# EAGLE schematic display-r2 (EAGLE 6.6.0)
DATABASE: /home/mike/core/eagle/partsdb.txt

## Sheet 1 of 9
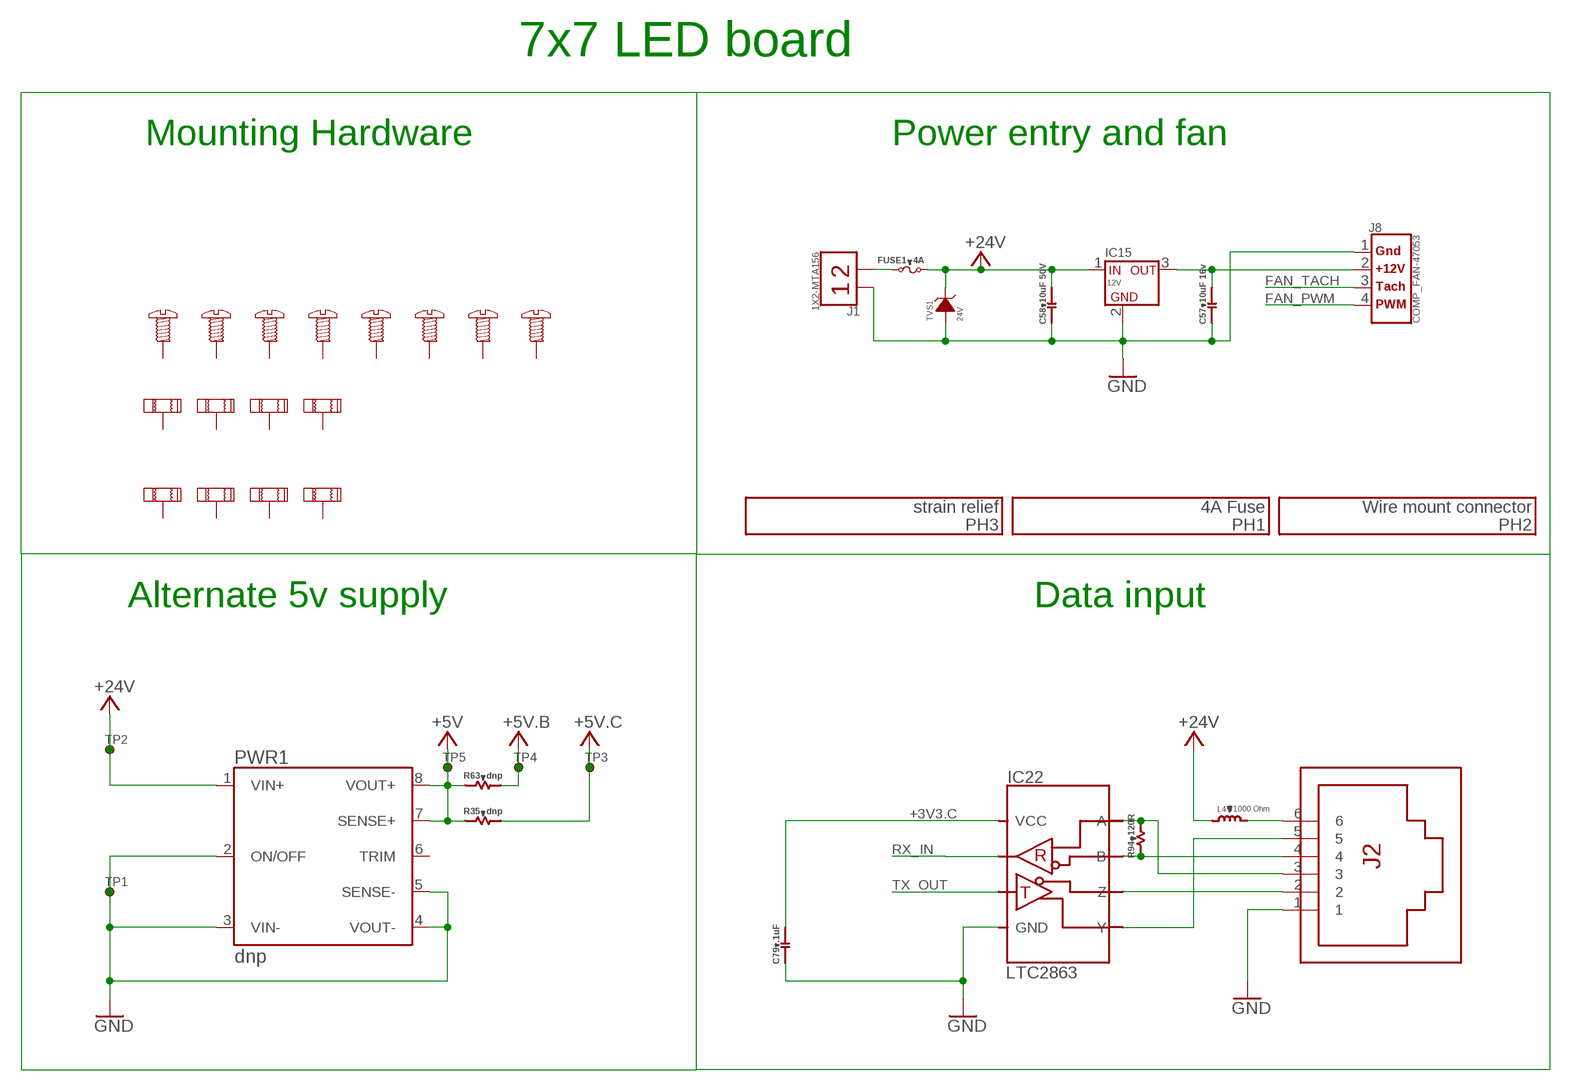
[diagram p0: schematic, sheet 1]
PH1 (BOM-PART): PARTNO: BK1-S505H-4-R
PH2 (BOM-PART): PARTNO: 3-644465-2
PH3 (BOM-PART): PARTNO: 643071-2

### Parts
C57  10uF 16v  C0805  [C0805B]
C58  10uF 50V  C1206  [C1206B]
C79  .1uF  C0603  [C0603B]
FUSE1  4A  F-649  [649]
IC15  12V  P7805-Q24-S12-S  [P7805]
IC22  LTC2863  [SO08]
J1  1X2-MTA156  [640445-2]
J2  RJ12-JACK-RJE01  [RJE01-660-01]
J8  COMP_FAN-47053  [47053]
L4  1000 Ohm  L0603  [R0603B]
NUT1  NUTSMTSO-632  [SMTSO-632-2ET]
NUT2  NUTSMTSO-632  [SMTSO-632-2ET]
NUT3  NUTSMTSO-632  [SMTSO-632-2ET]
NUT4  NUTSMTSO-632  [SMTSO-632-2ET]
NUT5  NUTSMTSO-832  [SMTSO-832-2ET]
NUT6  NUTSMTSO-832  [SMTSO-832-2ET]
NUT7  NUTSMTSO-832  [SMTSO-832-2ET]
NUT8  NUTSMTSO-832  [SMTSO-832-2ET]
PWR1  dnp  EHHD024A0A  [PWR-1/4-BRICK]
R35  dnp  R0805  [R0805B]
R63  dnp  R0805  [R0805B]
R94  120R  R1206  [R1206B]
SCREW1  SCREW-632-0-PSHP  [SMTPR-6-1]
SCREW2  SCREW-632-0-PSHP  [SMTPR-6-1]
SCREW3  SCREW-632-0-PSHP  [SMTPR-6-1]
SCREW4  SCREW-632-0-PSHP  [SMTPR-6-1]
SCREW5  SCREW-632-0-PSHP  [SMTPR-6-1]
SCREW6  SCREW-632-0-PSHP  [SMTPR-6-1]
SCREW7  SCREW-632-0-PSHP  [SMTPR-6-1]
SCREW8  SCREW-632-0-PSHP  [SMTPR-6-1]
TP1  TP-CIR30  [SMD_CIR30]
TP2  TP-CIR30  [SMD_CIR30]
TP3  TP-CIR30  [SMD_CIR30]
TP4  TP-CIR30  [SMD_CIR30]
TP5  TP-CIR30  [SMD_CIR30]
TVS1  24V  TVS-SMC  [SMC/DO214AB]

### Nets
+3V3.C: C79.2 IC22.1(VCC) ; also sheet 6
+5V: PWR1.7(SENSE+) PWR1.8(VOUT+) R35.1 R63.1 TP5.P$1 ; also sheet 4,5,7
+5VB: R63.2 TP4.P$1 ; supply symbol labelled +5V.B ; also sheet 2,5,6,8
+5VC: R35.2 TP3.P$1 ; supply symbol labelled +5V.C ; also sheet 2,3,9
+24V: C58.2 FUSE1.2 IC15.1(IN) L4.1 PWR1.1(VIN+) TP2.P$1 TVS1.C(CATHODE) ; also sheet 4,7,8,9
+24V_OUT: J2.6 L4.2
FAN_PWM: J8.4 ; also sheet 5
FAN_TACH: J8.3 ; also sheet 5
GND: C57.1 C58.1 C79.1 IC15.2(GND) IC22.4(GND) J1.1 J2.1 J8.1 PWR1.2(ON/OFF) PWR1.3(VIN-) PWR1.4(VOUT-) PWR1.5(SENSE-) TP1.P$1 TVS1.A(ANODE) ; also sheet 2,3,4,5,6,7,8,9
N$184: FUSE1.1 J1.2
N$185: IC22.7(B) J2.4 R94.1
N$186: IC22.8(A) J2.3 R94.2
N$187: IC22.6(Z) J2.2
N$188: IC22.5(Y) J2.5
OUT: C57.2 IC15.3(OUT) J8.2
RX_IN: IC22.2(RO) ; also sheet 2
TX_OUT: IC22.3(DI) ; also sheet 6
Unconnected: NUT1.P$1 NUT2.P$1 NUT3.P$1 NUT4.P$1 NUT5.1 NUT6.1 NUT7.1 NUT8.1 PWR1.6(TRIM) SCREW1.P$1 SCREW2.P$1 SCREW3.P$1 SCREW4.P$1 SCREW5.P$1 SCREW6.P$1 SCREW7.P$1 SCREW8.P$1

### Notes on the sheet
- 7x7 LED board
- Mounting Hardware | Power entry and fan
- Alternate 5v supply | Data input

## Sheet 2 of 9
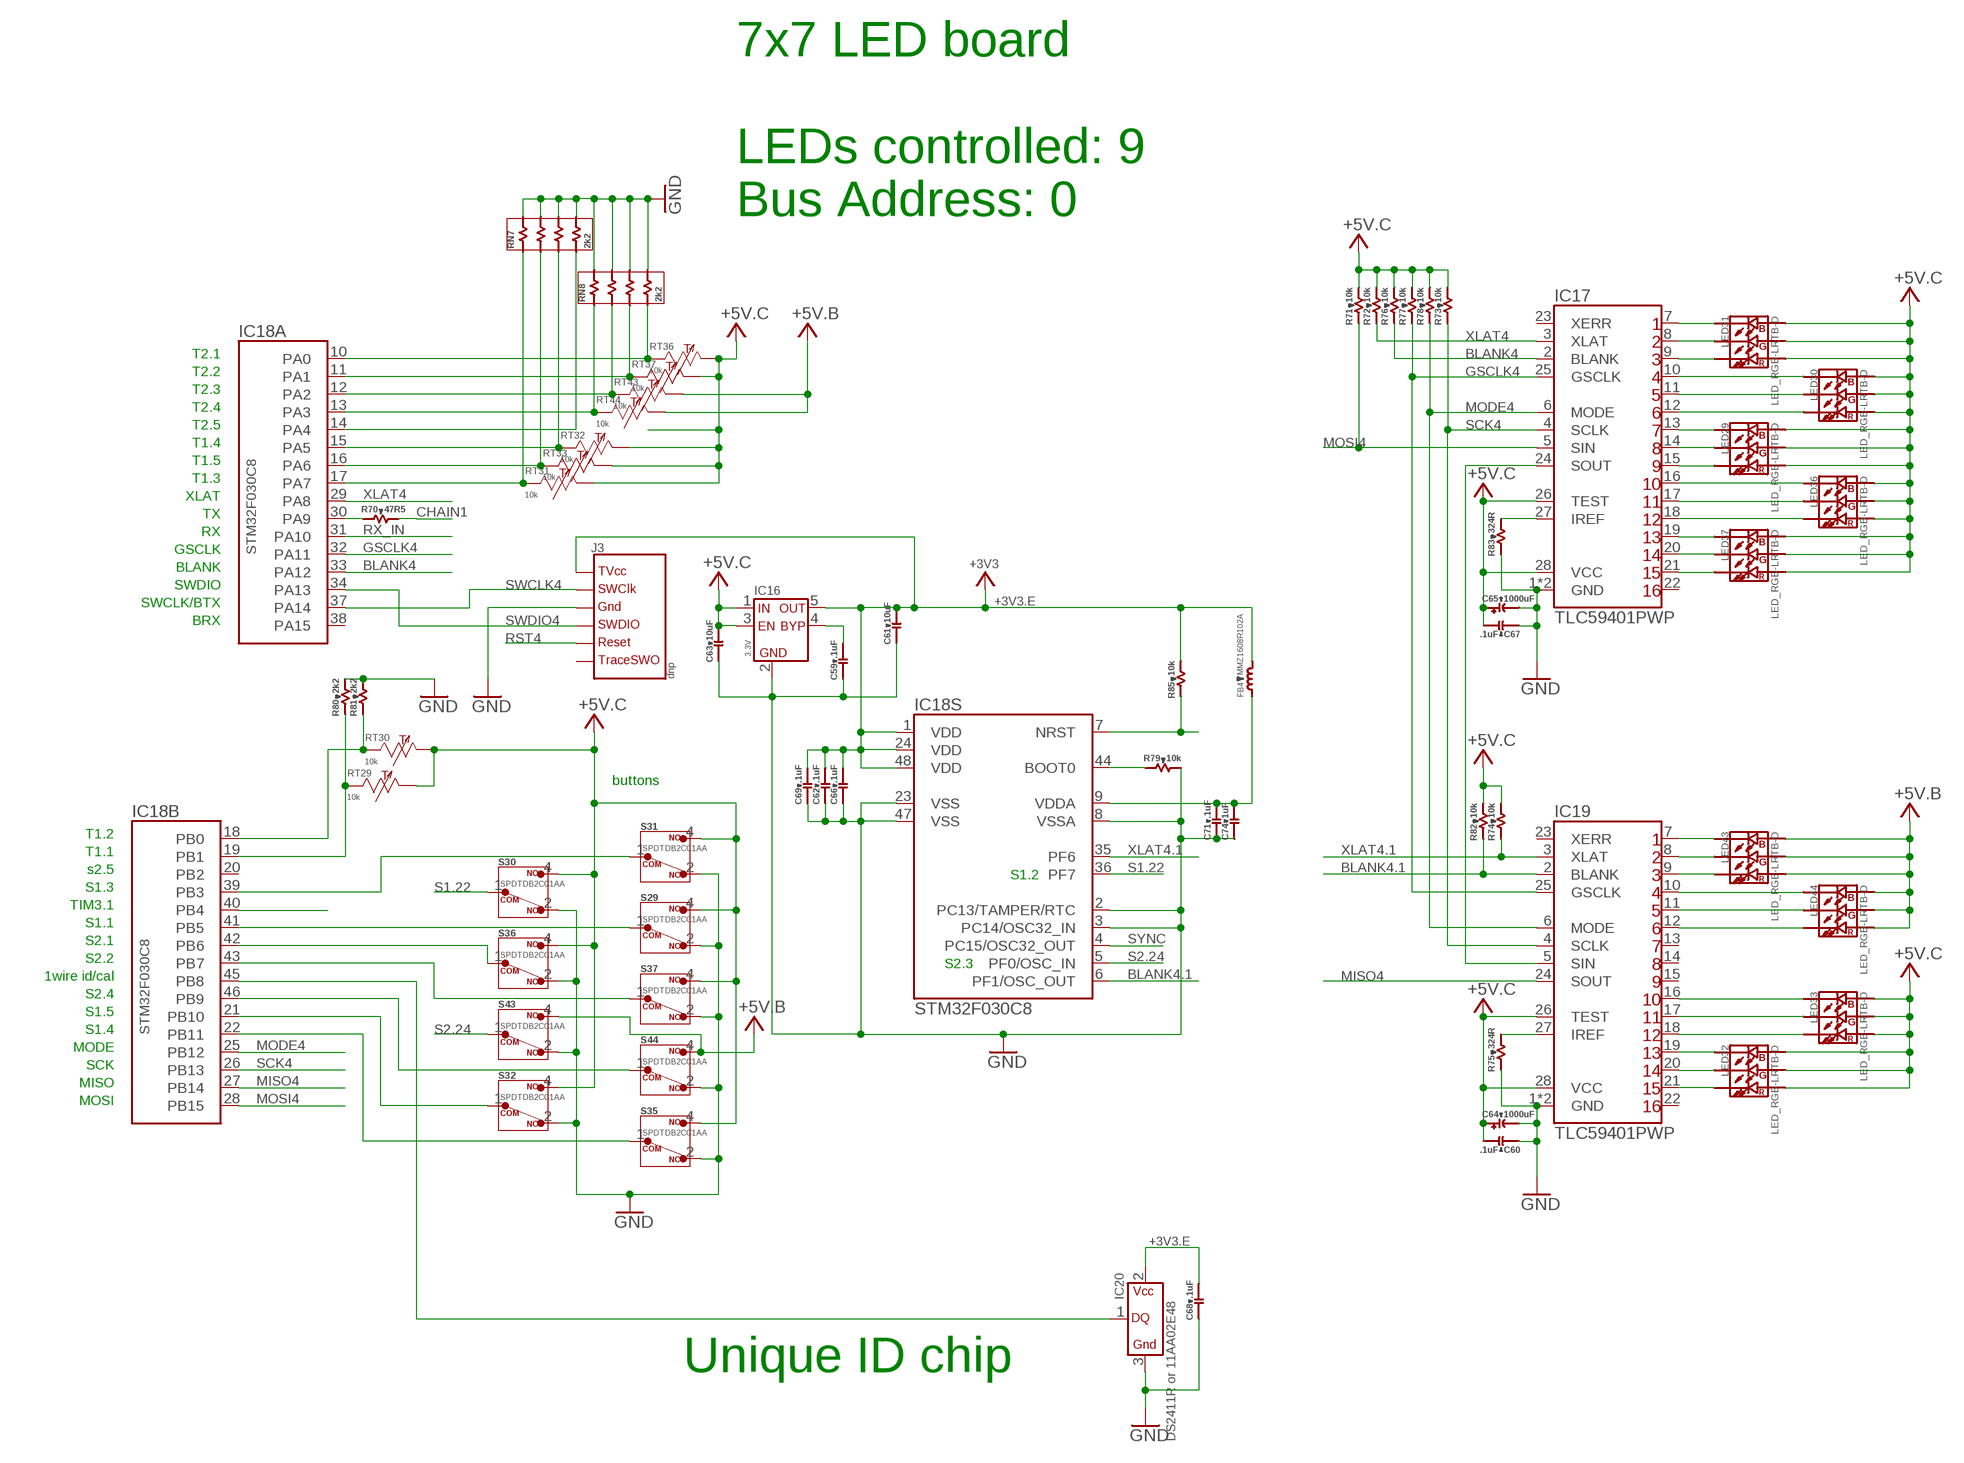
[diagram p1: schematic, sheet 2]

### Parts
C59  .1uF  C0603  [C0603B]
C60  .1uF  C0603  [C0603B]
C61  10uF  C0603  [C0603B]
C62  .1uF  C0603  [C0603B]
C63  10uF  C0603  [C0603B]
C64  1000uF  CPOL-TH-5-10.5  [E5-10,5]
C65  1000uF  CPOL-TH-5-10.5  [E5-10,5]
C66  .1uF  C0603  [C0603B]
C67  .1uF  C0603  [C0603B]
C68  .1uF  C0603  [C0603B]
C69  .1uF  C0603  [C0603B]
C71  .1uF  C0603  [C0603B]
C74  1uF  C0603  [C0603B]
FB4  MMZ1608R102A  FB0603  [R0603B]
IC16  3.3V  TC2185  [SOT-23-5]
IC17  TLC59401PWP  [TSSOP28_PAD]
IC18  STM32F030C8  [LQFP-48]
IC19  TLC59401PWP  [TSSOP28_PAD]
IC20  DS2411R or 11AA02E48  DS2411R  [SOT-23]
J3  dnp  STM32-SW-TC2030  [TC2030-IDC-NL]
LED29  LED_RGB-LRTB-D  [LRTB_C9TP-D]
LED30  LED_RGB-LRTB-D  [LRTB_C9TP-D]
LED31  LED_RGB-LRTB-D  [LRTB_C9TP-D]
LED32  LED_RGB-LRTB-D  [LRTB_C9TP-D]
LED33  LED_RGB-LRTB-D  [LRTB_C9TP-D]
LED36  LED_RGB-LRTB-D  [LRTB_C9TP-D]
LED37  LED_RGB-LRTB-D  [LRTB_C9TP-D]
LED43  LED_RGB-LRTB-D  [LRTB_C9TP-D]
LED44  LED_RGB-LRTB-D  [LRTB_C9TP-D]
R70  47R5  R0603  [R0603B]
R71  10k  R0603  [R0603B]
R72  10k  R0603  [R0603B]
R73  10k  R0603  [R0603B]
R74  10k  R0603  [R0603B]
R75  324R  R0603  [R0603B]
R76  10k  R0603  [R0603B]
R77  10k  R0603  [R0603B]
R78  10k  R0603  [R0603B]
R79  10k  R0603  [R0603B]
R80  2k2  R0603  [R0603B]
R81  2k2  R0603  [R0603B]
R82  10k  R0603  [R0603B]
R83  324R  R0603  [R0603B]
R85  10k  R0603  [R0603B]
RN7  2k2  R4_CAY16  [CAY16]
RN8  2k2  R4_CAY16  [CAY16]
RT29  10k  RT0603  [R0603Y]
RT30  10k  RT0603  [R0603Y]
RT31  10k  RT0603  [R0603Y]
RT32  10k  RT0603  [R0603Y]
RT33  10k  RT0603  [R0603Y]
RT36  10k  RT0603  [R0603Y]
RT37  10k  RT0603  [R0603Y]
RT43  10k  RT0603  [R0603Y]
RT44  10k  RT0603  [R0603Y]
S29  SPDTDB2CC1AA  [DB2CC1AA]
S30  SPDTDB2CC1AA  [DB2CC1AA]
S31  SPDTDB2CC1AA  [DB2CC1AA]
S32  SPDTDB2CC1AA  [DB2CC1AA]
S35  SPDTDB2CC1AA  [DB2CC1AA]
S36  SPDTDB2CC1AA  [DB2CC1AA]
S37  SPDTDB2CC1AA  [DB2CC1AA]
S43  SPDTDB2CC1AA  [DB2CC1AA]
S44  SPDTDB2CC1AA  [DB2CC1AA]

### Nets
+3V3.E: C61.2 C62.2 C66.2 C68.2 C69.2 FB4.2 IC16.5(OUT) IC18.1(S:VDD) IC18.24(S:VDD) IC18.48(S:VDD) IC20.2(VCC) J3.1(TVCC) R85.2 ; supply symbol labelled +3V3
+5VB: LED43.A1(ANODE_R) LED43.A2(ANODE_G) LED43.A3(ANODE_B) LED44.A1(ANODE_R) LED44.A2(ANODE_G) LED44.A3(ANODE_B) RT43.2 RT44.2 S43.4(NO) S44.4(NO) ; supply symbol labelled +5V.B ; also sheet 1,5,6,8
+5VC: C60.2 C63.2 C64.+ C65.+ C67.2 IC16.1(IN) IC16.3(EN) IC17.26(TEST) IC17.28(VCC) IC19.26(TEST) IC19.28(VCC) LED29.A1(ANODE_R) LED29.A2(ANODE_G) LED29.A3(ANODE_B) LED30.A1(ANODE_R) LED30.A2(ANODE_G) LED30.A3(ANODE_B) LED31.A1(ANODE_R) LED31.A2(ANODE_G) LED31.A3(ANODE_B) LED32.A1(ANODE_R) LED32.A2(ANODE_G) LED32.A3(ANODE_B) LED33.A1(ANODE_R) LED33.A2(ANODE_G) LED33.A3(ANODE_B) LED36.A1(ANODE_R) LED36.A2(ANODE_G) LED36.A3(ANODE_B) LED37.A1(ANODE_R) LED37.A2(ANODE_G) LED37.A3(ANODE_B) R71.2 R72.2 R73.2 R74.2 R76.2 R77.2 R78.2 R82.2 RT29.2 RT30.2 RT31.2 RT32.2 RT33.2 RT36.2 RT37.2 S29.4(NO) S30.4(NO) S31.4(NO) S32.4(NO) S35.4(NO) S36.4(NO) S37.4(NO) ; supply symbol labelled +5V.C ; also sheet 1,3,9
BLANK4: IC17.2(BLANK) IC18.33(A:PA12) R76.1
BLANK4.1: IC18.6(S:PF1/OSC_OUT) IC19.2(BLANK) R82.1
CHAIN1: R70.2 ; also sheet 3
GND: C59.1 C60.1 C61.1 C62.1 C63.1 C64.- C65.- C66.1 C67.1 C68.1 C69.1 C71.1 C74.1 IC16.2(GND) IC17.1(GND) IC17.PAD(GND) IC18.2(S:PC13/TAMPER/RTC) IC18.3(S:PC14/OSC32_IN) IC18.8(S:VSSA) IC18.23(S:VSS) IC18.47(S:VSS) IC19.1(GND) IC19.PAD(GND) IC20.3(GND) J3.5(GND) R75.1 R79.2 R80.2 R81.2 R83.1 RN7.A2 RN7.B2 RN7.C2 RN7.D2 RN8.A2 RN8.B2 RN8.C2 RN8.D2 S29.2(NC) S30.2(NC) S31.2(NC) S32.2(NC) S35.2(NC) S36.2(NC) S37.2(NC) S43.2(NC) S44.2(NC) ; also sheet 1,3,4,5,6,7,8,9
GSCLK4: IC17.25(GSCLK) IC18.32(A:PA11) IC19.25(GSCLK) R77.1
MISO4: IC18.27(B:PB14) IC19.24(SOUT)
MODE4: IC17.6(MODE) IC18.25(B:PB12) IC19.6(MODE) R78.1
MOSI4: IC17.5(SIN) IC18.28(B:PB15) R71.1
N$145: IC18.44(S:BOOT0) R79.1
N$146: C71.2 C74.2 FB4.1 IC18.9(S:VDDA)
N$147: C59.2 IC16.4(BYPASS)
N$148: IC17.24(SOUT) IC19.5(SIN)
N$149: IC19.27(IREF) R75.2
N$150: IC17.27(IREF) R83.2
N$151: IC17.7(OUT1) LED31.C3(CATHODE_B)
N$152: IC17.8(OUT2) LED31.C2(CATHODE_G)
N$153: IC17.9(OUT3) LED31.C1(CATHODE_R)
N$154: IC17.10(OUT4) LED30.C3(CATHODE_B)
N$155: IC17.11(OUT5) LED30.C2(CATHODE_G)
N$156: IC17.12(OUT6) LED30.C1(CATHODE_R)
N$157: IC17.13(OUT7) LED29.C3(CATHODE_B)
N$158: IC17.14(OUT8) LED29.C2(CATHODE_G)
N$159: IC17.15(OUT9) LED29.C1(CATHODE_R)
N$160: IC17.16(OUT10) LED36.C3(CATHODE_B)
N$161: IC17.17(OUT11) LED36.C2(CATHODE_G)
N$162: IC17.18(OUT12) LED36.C1(CATHODE_R)
N$163: IC17.19(OUT13) LED37.C3(CATHODE_B)
N$164: IC17.20(OUT14) LED37.C2(CATHODE_G)
N$165: IC17.21(OUT15) LED37.C1(CATHODE_R)
N$166: IC19.7(OUT1) LED43.C3(CATHODE_B)
N$167: IC19.8(OUT2) LED43.C2(CATHODE_G)
N$168: IC19.9(OUT3) LED43.C1(CATHODE_R)
N$169: IC19.10(OUT4) LED44.C3(CATHODE_B)
N$170: IC19.11(OUT5) LED44.C2(CATHODE_G)
N$171: IC19.12(OUT6) LED44.C1(CATHODE_R)
N$175: IC19.16(OUT10) LED33.C3(CATHODE_B)
N$176: IC19.17(OUT11) LED33.C2(CATHODE_G)
N$177: IC19.18(OUT12) LED33.C1(CATHODE_R)
N$178: IC19.19(OUT13) LED32.C3(CATHODE_B)
N$179: IC19.20(OUT14) LED32.C2(CATHODE_G)
N$180: IC19.21(OUT15) LED32.C1(CATHODE_R)
N$194: IC18.30(A:PA9) R70.1
RST4: IC18.7(S:NRST) J3.3(RESET) R85.1
RX_IN: IC18.31(A:PA10) ; also sheet 1
S1.21: IC18.39(B:PB3) S31.1(COM)
S1.22: IC18.36(S:PF7) S30.1(COM)
S1.23: IC18.41(B:PB5) S29.1(COM)
S1.24: IC18.21(B:PB10) S32.1(COM)
S1.25: IC18.22(B:PB11) S35.1(COM)
S2.22: IC18.42(B:PB6) S36.1(COM)
S2.23: IC18.43(B:PB7) S37.1(COM)
S2.24: IC18.5(S:PF0/OSC_IN) S43.1(COM)
S2.25: IC18.46(B:PB9) S44.1(COM)
SCK4: IC17.4(SCLK) IC18.26(B:PB13) IC19.4(SCLK) R73.1
SWCLK4: IC18.37(A:PA14) J3.4(SWCLK)
SWDIO4: IC18.34(A:PA13) J3.2(SWDIO)
SYNC: IC18.4(S:PC15/OSC32_OUT) ; also sheet 3,4,5,6
T41: IC18.14(A:PA4) RN7.D1
T42: IC18.15(A:PA5) RN7.C1 RT32.1
T43: IC18.16(A:PA6) RN7.B1 RT33.1
T44: IC18.17(A:PA7) RN7.A1 RT31.1
T45: IC18.18(B:PB0) R81.1 RT30.1
T46: IC18.19(B:PB1) R80.1 RT29.1
T47: IC18.13(A:PA3) RN8.A1 RT44.1
T48: IC18.12(A:PA2) RN8.B1 RT43.1
T49: IC18.11(A:PA1) RN8.C1 RT37.1
T50: IC18.10(A:PA0) RN8.D1 RT36.1
TIM3.5: IC18.40(B:PB4)
TIM16.5: IC18.45(B:PB8) IC20.1(DQ)
XLAT4: IC17.3(XLAT) IC18.29(A:PA8) R72.1
XLAT4.1: IC18.35(S:PF6) IC19.3(XLAT) R74.1
Unconnected: IC17.22(OUT16) IC17.23(XERR) IC18.20(B:PB2) IC18.38(A:PA15) IC19.13(OUT7) IC19.14(OUT8) IC19.15(OUT9) IC19.22(OUT16) IC19.23(XERR) J3.6(TRACESWO)

### Notes on the sheet
- 7x7 LED board
- LEDs controlled: 9
  Bus Address: 0
- T2.1
- T2.2
- T2.3
- T2.4
- T2.5
- T1.4
- T1.5
- T1.3
- XLAT
- TX
- RX
- GSCLK
- BLANK
- SWDIO
- SWCLK/BTX
- BRX
- buttons
- T1.2
- T1.1
- s2.5
- S1.2
- S1.3
- TIM3.1
- S1.1
- S2.1
- S2.2
- S2.3
- 1wire id/cal
- S2.4
- S1.5
- S1.4
- MODE
- SCK
- MISO
- MOSI
- Unique ID chip

## Sheet 3 of 9
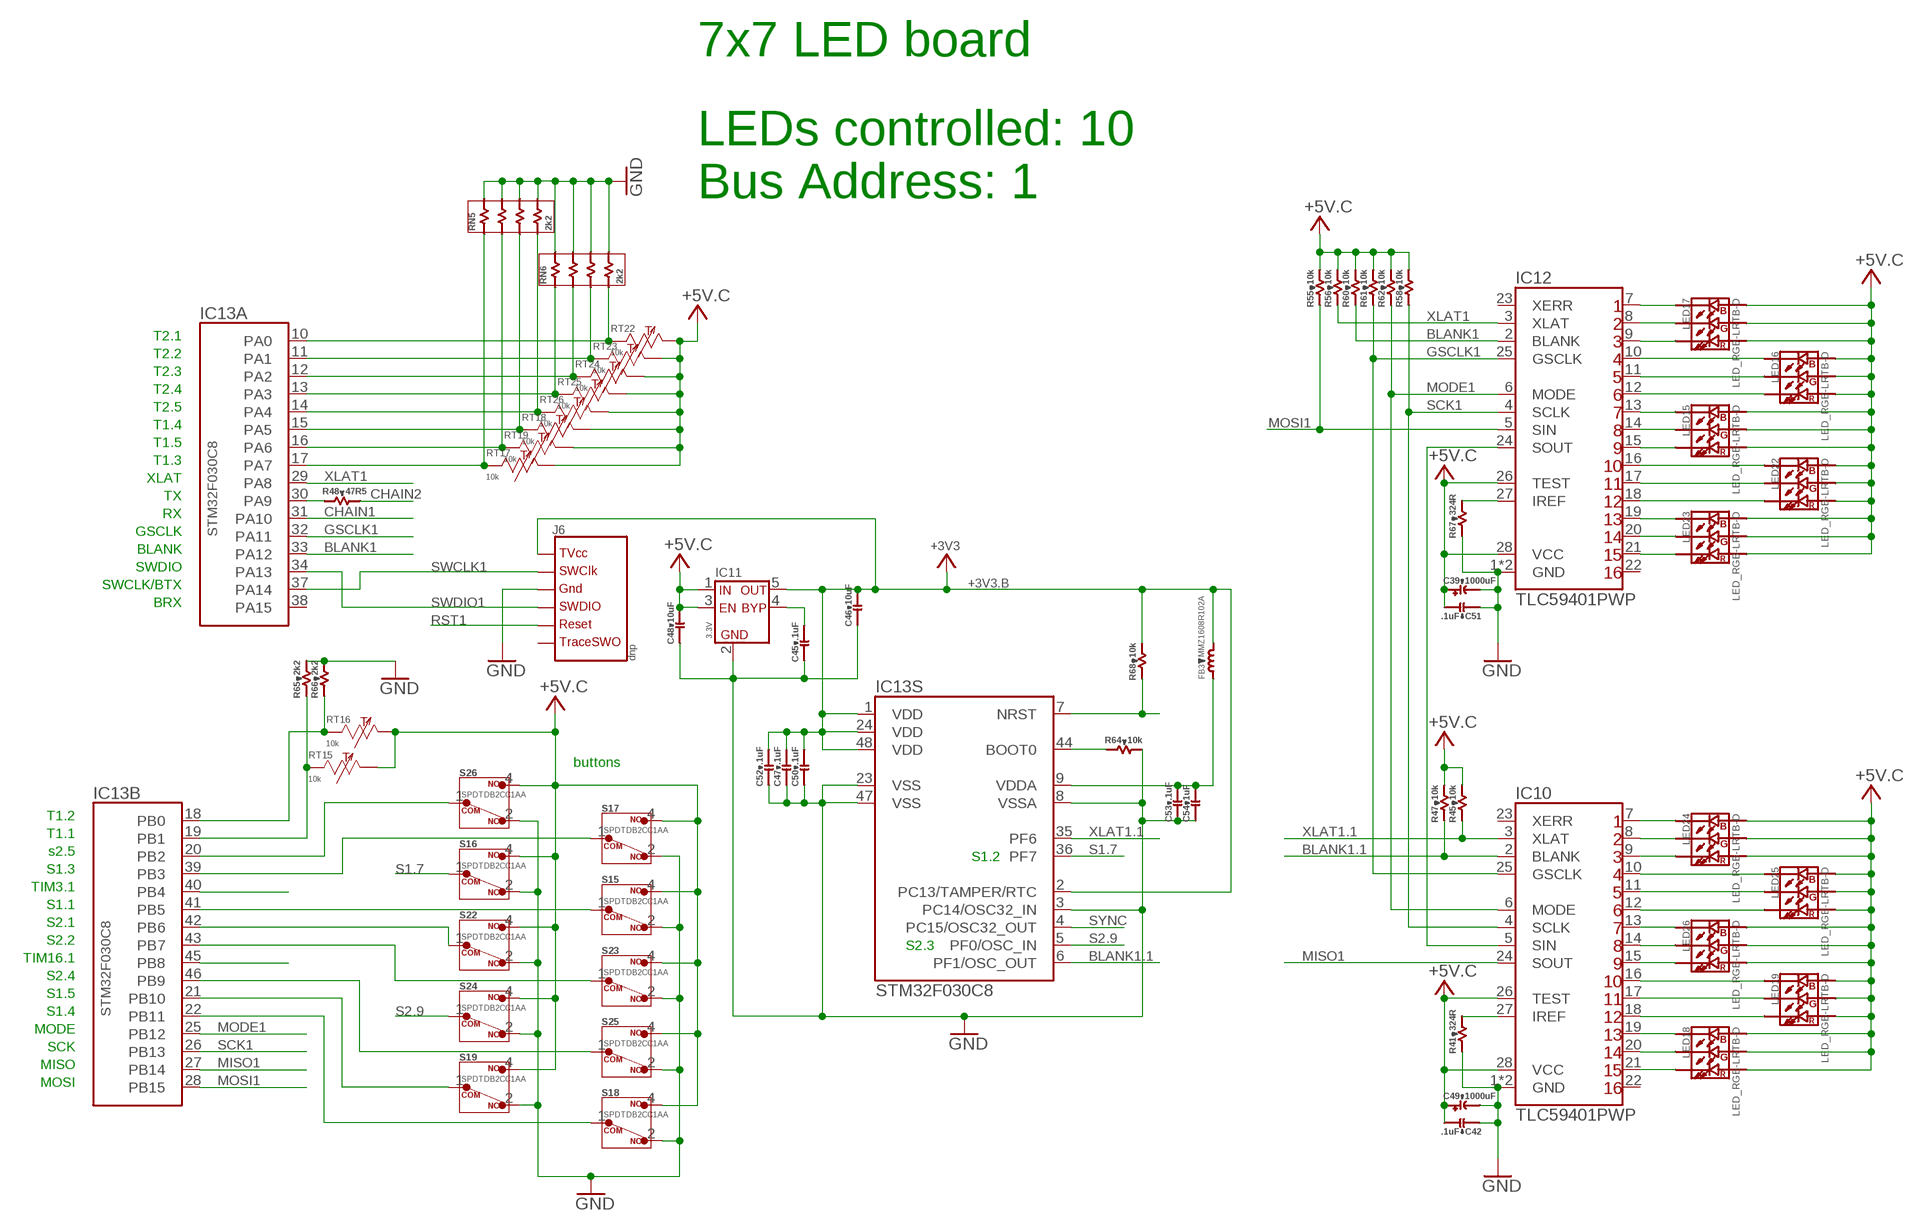
[diagram p2: schematic, sheet 3]

### Parts
C39  1000uF  CPOL-TH-5-10.5  [E5-10,5]
C42  .1uF  C0603  [C0603B]
C45  .1uF  C0603  [C0603B]
C46  10uF  C0603  [C0603B]
C47  .1uF  C0603  [C0603B]
C48  10uF  C0603  [C0603B]
C49  1000uF  CPOL-TH-5-10.5  [E5-10,5]
C50  .1uF  C0603  [C0603B]
C51  .1uF  C0603  [C0603B]
C52  .1uF  C0603  [C0603B]
C53  .1uF  C0603  [C0603B]
C54  1uF  C0603  [C0603B]
FB3  MMZ1608R102A  FB0603  [R0603B]
IC10  TLC59401PWP  [TSSOP28_PAD]
IC11  3.3V  TC2185  [SOT-23-5]
IC12  TLC59401PWP  [TSSOP28_PAD]
IC13  STM32F030C8  [LQFP-48]
J6  dnp  STM32-SW-TC2030  [TC2030-IDC-NL]
LED15  LED_RGB-LRTB-D  [LRTB_C9TP-D]
LED16  LED_RGB-LRTB-D  [LRTB_C9TP-D]
LED17  LED_RGB-LRTB-D  [LRTB_C9TP-D]
LED18  LED_RGB-LRTB-D  [LRTB_C9TP-D]
LED19  LED_RGB-LRTB-D  [LRTB_C9TP-D]
LED22  LED_RGB-LRTB-D  [LRTB_C9TP-D]
LED23  LED_RGB-LRTB-D  [LRTB_C9TP-D]
LED24  LED_RGB-LRTB-D  [LRTB_C9TP-D]
LED25  LED_RGB-LRTB-D  [LRTB_C9TP-D]
LED26  LED_RGB-LRTB-D  [LRTB_C9TP-D]
R41  324R  R0603  [R0603B]
R45  10k  R0603  [R0603B]
R47  10k  R0603  [R0603B]
R48  47R5  R0603  [R0603B]
R55  10k  R0603  [R0603B]
R56  10k  R0603  [R0603B]
R58  10k  R0603  [R0603B]
R60  10k  R0603  [R0603B]
R61  10k  R0603  [R0603B]
R62  10k  R0603  [R0603B]
R64  10k  R0603  [R0603B]
R65  2k2  R0603  [R0603B]
R66  2k2  R0603  [R0603B]
R67  324R  R0603  [R0603B]
R68  10k  R0603  [R0603B]
RN5  2k2  R4_CAY16  [CAY16]
RN6  2k2  R4_CAY16  [CAY16]
RT15  10k  RT0603  [R0603Y]
RT16  10k  RT0603  [R0603Y]
RT17  10k  RT0603  [R0603Y]
RT18  10k  RT0603  [R0603Y]
RT19  10k  RT0603  [R0603Y]
RT22  10k  RT0603  [R0603Y]
RT23  10k  RT0603  [R0603Y]
RT24  10k  RT0603  [R0603Y]
RT25  10k  RT0603  [R0603Y]
RT26  10k  RT0603  [R0603Y]
S15  SPDTDB2CC1AA  [DB2CC1AA]
S16  SPDTDB2CC1AA  [DB2CC1AA]
S17  SPDTDB2CC1AA  [DB2CC1AA]
S18  SPDTDB2CC1AA  [DB2CC1AA]
S19  SPDTDB2CC1AA  [DB2CC1AA]
S22  SPDTDB2CC1AA  [DB2CC1AA]
S23  SPDTDB2CC1AA  [DB2CC1AA]
S24  SPDTDB2CC1AA  [DB2CC1AA]
S25  SPDTDB2CC1AA  [DB2CC1AA]
S26  SPDTDB2CC1AA  [DB2CC1AA]

### Nets
+3V3.B: C46.2 C47.2 C50.2 C52.2 FB3.2 IC11.5(OUT) IC13.1(S:VDD) IC13.2(S:PC13/TAMPER/RTC) IC13.24(S:VDD) IC13.48(S:VDD) J6.1(TVCC) R68.2 ; supply symbol labelled +3V3
+5VC: C39.+ C42.2 C48.2 C49.+ C51.2 IC10.26(TEST) IC10.28(VCC) IC11.1(IN) IC11.3(EN) IC12.26(TEST) IC12.28(VCC) LED15.A1(ANODE_R) LED15.A2(ANODE_G) LED15.A3(ANODE_B) LED16.A1(ANODE_R) LED16.A2(ANODE_G) LED16.A3(ANODE_B) LED17.A1(ANODE_R) LED17.A2(ANODE_G) LED17.A3(ANODE_B) LED18.A1(ANODE_R) LED18.A2(ANODE_G) LED18.A3(ANODE_B) LED19.A1(ANODE_R) LED19.A2(ANODE_G) LED19.A3(ANODE_B) LED22.A1(ANODE_R) LED22.A2(ANODE_G) LED22.A3(ANODE_B) LED23.A1(ANODE_R) LED23.A2(ANODE_G) LED23.A3(ANODE_B) LED24.A1(ANODE_R) LED24.A2(ANODE_G) LED24.A3(ANODE_B) LED25.A1(ANODE_R) LED25.A2(ANODE_G) LED25.A3(ANODE_B) LED26.A1(ANODE_R) LED26.A2(ANODE_G) LED26.A3(ANODE_B) R45.2 R47.2 R55.2 R56.2 R58.2 R60.2 R61.2 R62.2 RT15.2 RT16.2 RT17.2 RT18.2 RT19.2 RT22.2 RT23.2 RT24.2 RT25.2 RT26.2 S15.4(NO) S16.4(NO) S17.4(NO) S18.4(NO) S19.4(NO) S22.4(NO) S23.4(NO) S24.4(NO) S25.4(NO) S26.4(NO) ; supply symbol labelled +5V.C ; also sheet 1,2,9
BLANK1: IC12.2(BLANK) IC13.33(A:PA12) R60.1
BLANK1.1: IC10.2(BLANK) IC13.6(S:PF1/OSC_OUT) R47.1
CHAIN1: IC13.31(A:PA10) ; also sheet 2
CHAIN2: R48.2 ; also sheet 4
GND: C39.- C42.1 C45.1 C46.1 C47.1 C48.1 C49.- C50.1 C51.1 C52.1 C53.1 C54.1 IC10.1(GND) IC10.PAD(GND) IC11.2(GND) IC12.1(GND) IC12.PAD(GND) IC13.3(S:PC14/OSC32_IN) IC13.8(S:VSSA) IC13.23(S:VSS) IC13.47(S:VSS) J6.5(GND) R41.1 R64.2 R65.2 R66.2 R67.1 RN5.A2 RN5.B2 RN5.C2 RN5.D2 RN6.A2 RN6.B2 RN6.C2 RN6.D2 S15.2(NC) S16.2(NC) S17.2(NC) S18.2(NC) S19.2(NC) S22.2(NC) S23.2(NC) S24.2(NC) S25.2(NC) S26.2(NC) ; also sheet 1,2,4,5,6,7,8,9
GSCLK1: IC10.25(GSCLK) IC12.25(GSCLK) IC13.32(A:PA11) R61.1
MISO1: IC10.24(SOUT) IC13.27(B:PB14)
MODE1: IC10.6(MODE) IC12.6(MODE) IC13.25(B:PB12) R62.1
MOSI1: IC12.5(SIN) IC13.28(B:PB15) R55.1
N$2: IC13.44(S:BOOT0) R64.1
N$23: C53.2 C54.2 FB3.1 IC13.9(S:VDDA)
N$24: C45.2 IC11.4(BYPASS)
N$40: IC10.5(SIN) IC12.24(SOUT)
N$41: IC10.27(IREF) R41.2
N$42: IC12.27(IREF) R67.2
N$43: IC12.7(OUT1) LED17.C3(CATHODE_B)
N$44: IC12.8(OUT2) LED17.C2(CATHODE_G)
N$45: IC12.9(OUT3) LED17.C1(CATHODE_R)
N$46: IC12.10(OUT4) LED16.C3(CATHODE_B)
N$47: IC12.11(OUT5) LED16.C2(CATHODE_G)
N$48: IC12.12(OUT6) LED16.C1(CATHODE_R)
N$49: IC12.13(OUT7) LED15.C3(CATHODE_B)
N$50: IC12.14(OUT8) LED15.C2(CATHODE_G)
N$51: IC12.15(OUT9) LED15.C1(CATHODE_R)
N$52: IC12.16(OUT10) LED22.C3(CATHODE_B)
N$53: IC12.17(OUT11) LED22.C2(CATHODE_G)
N$54: IC12.18(OUT12) LED22.C1(CATHODE_R)
N$55: IC12.19(OUT13) LED23.C3(CATHODE_B)
N$56: IC12.20(OUT14) LED23.C2(CATHODE_G)
N$57: IC12.21(OUT15) LED23.C1(CATHODE_R)
N$58: IC10.7(OUT1) LED24.C3(CATHODE_B)
N$59: IC10.8(OUT2) LED24.C2(CATHODE_G)
N$60: IC10.9(OUT3) LED24.C1(CATHODE_R)
N$61: IC10.10(OUT4) LED25.C3(CATHODE_B)
N$62: IC10.11(OUT5) LED25.C2(CATHODE_G)
N$63: IC10.12(OUT6) LED25.C1(CATHODE_R)
N$64: IC10.13(OUT7) LED26.C3(CATHODE_B)
N$65: IC10.14(OUT8) LED26.C2(CATHODE_G)
N$66: IC10.15(OUT9) LED26.C1(CATHODE_R)
N$67: IC10.16(OUT10) LED19.C3(CATHODE_B)
N$68: IC10.17(OUT11) LED19.C2(CATHODE_G)
N$69: IC10.18(OUT12) LED19.C1(CATHODE_R)
N$70: IC10.19(OUT13) LED18.C3(CATHODE_B)
N$71: IC10.20(OUT14) LED18.C2(CATHODE_G)
N$72: IC10.21(OUT15) LED18.C1(CATHODE_R)
N$191: IC13.30(A:PA9) R48.1
RST1: IC13.7(S:NRST) J6.3(RESET) R68.1
S1.6: IC13.39(B:PB3) S17.1(COM)
S1.7: IC13.36(S:PF7) S16.1(COM)
S1.8: IC13.41(B:PB5) S15.1(COM)
S1.9: IC13.21(B:PB10) S19.1(COM)
S1.10: IC13.22(B:PB11) S18.1(COM)
S2.6: IC13.20(B:PB2) S26.1(COM)
S2.7: IC13.42(B:PB6) S22.1(COM)
S2.8: IC13.43(B:PB7) S23.1(COM)
S2.9: IC13.5(S:PF0/OSC_IN) S24.1(COM)
S2.10: IC13.46(B:PB9) S25.1(COM)
SCK1: IC10.4(SCLK) IC12.4(SCLK) IC13.26(B:PB13) R58.1
SWCLK1: IC13.37(A:PA14) J6.4(SWCLK)
SWDIO1: IC13.34(A:PA13) J6.2(SWDIO)
SYNC: IC13.4(S:PC15/OSC32_OUT) ; also sheet 2,4,5,6
T11: IC13.14(A:PA4) RN5.D1 RT26.1
T12: IC13.15(A:PA5) RN5.C1 RT18.1
T13: IC13.16(A:PA6) RN5.B1 RT19.1
T14: IC13.17(A:PA7) RN5.A1 RT17.1
T15: IC13.18(B:PB0) R66.1 RT16.1
T16: IC13.19(B:PB1) R65.1 RT15.1
T17: IC13.13(A:PA3) RN6.A1 RT25.1
T18: IC13.12(A:PA2) RN6.B1 RT24.1
T19: IC13.11(A:PA1) RN6.C1 RT23.1
T20: IC13.10(A:PA0) RN6.D1 RT22.1
TIM3.2: IC13.40(B:PB4)
TIM16.2: IC13.45(B:PB8)
XLAT1: IC12.3(XLAT) IC13.29(A:PA8) R56.1
XLAT1.1: IC10.3(XLAT) IC13.35(S:PF6) R45.1
Unconnected: IC10.22(OUT16) IC10.23(XERR) IC12.22(OUT16) IC12.23(XERR) IC13.38(A:PA15) J6.6(TRACESWO)

### Notes on the sheet
- 7x7 LED board
- LEDs controlled: 10
  Bus Address: 1
- T2.1
- T2.2
- T2.3
- T2.4
- T2.5
- T1.4
- T1.5
- T1.3
- XLAT
- TX
- RX
- GSCLK
- BLANK
- SWDIO
- SWCLK/BTX
- BRX
- buttons
- T1.2
- T1.1
- s2.5
- S1.2
- S1.3
- TIM3.1
- S1.1
- S2.1
- S2.2
- S2.3
- TIM16.1
- S2.4
- S1.5
- S1.4
- MODE
- SCK
- MISO
- MOSI

## Sheet 4 of 9
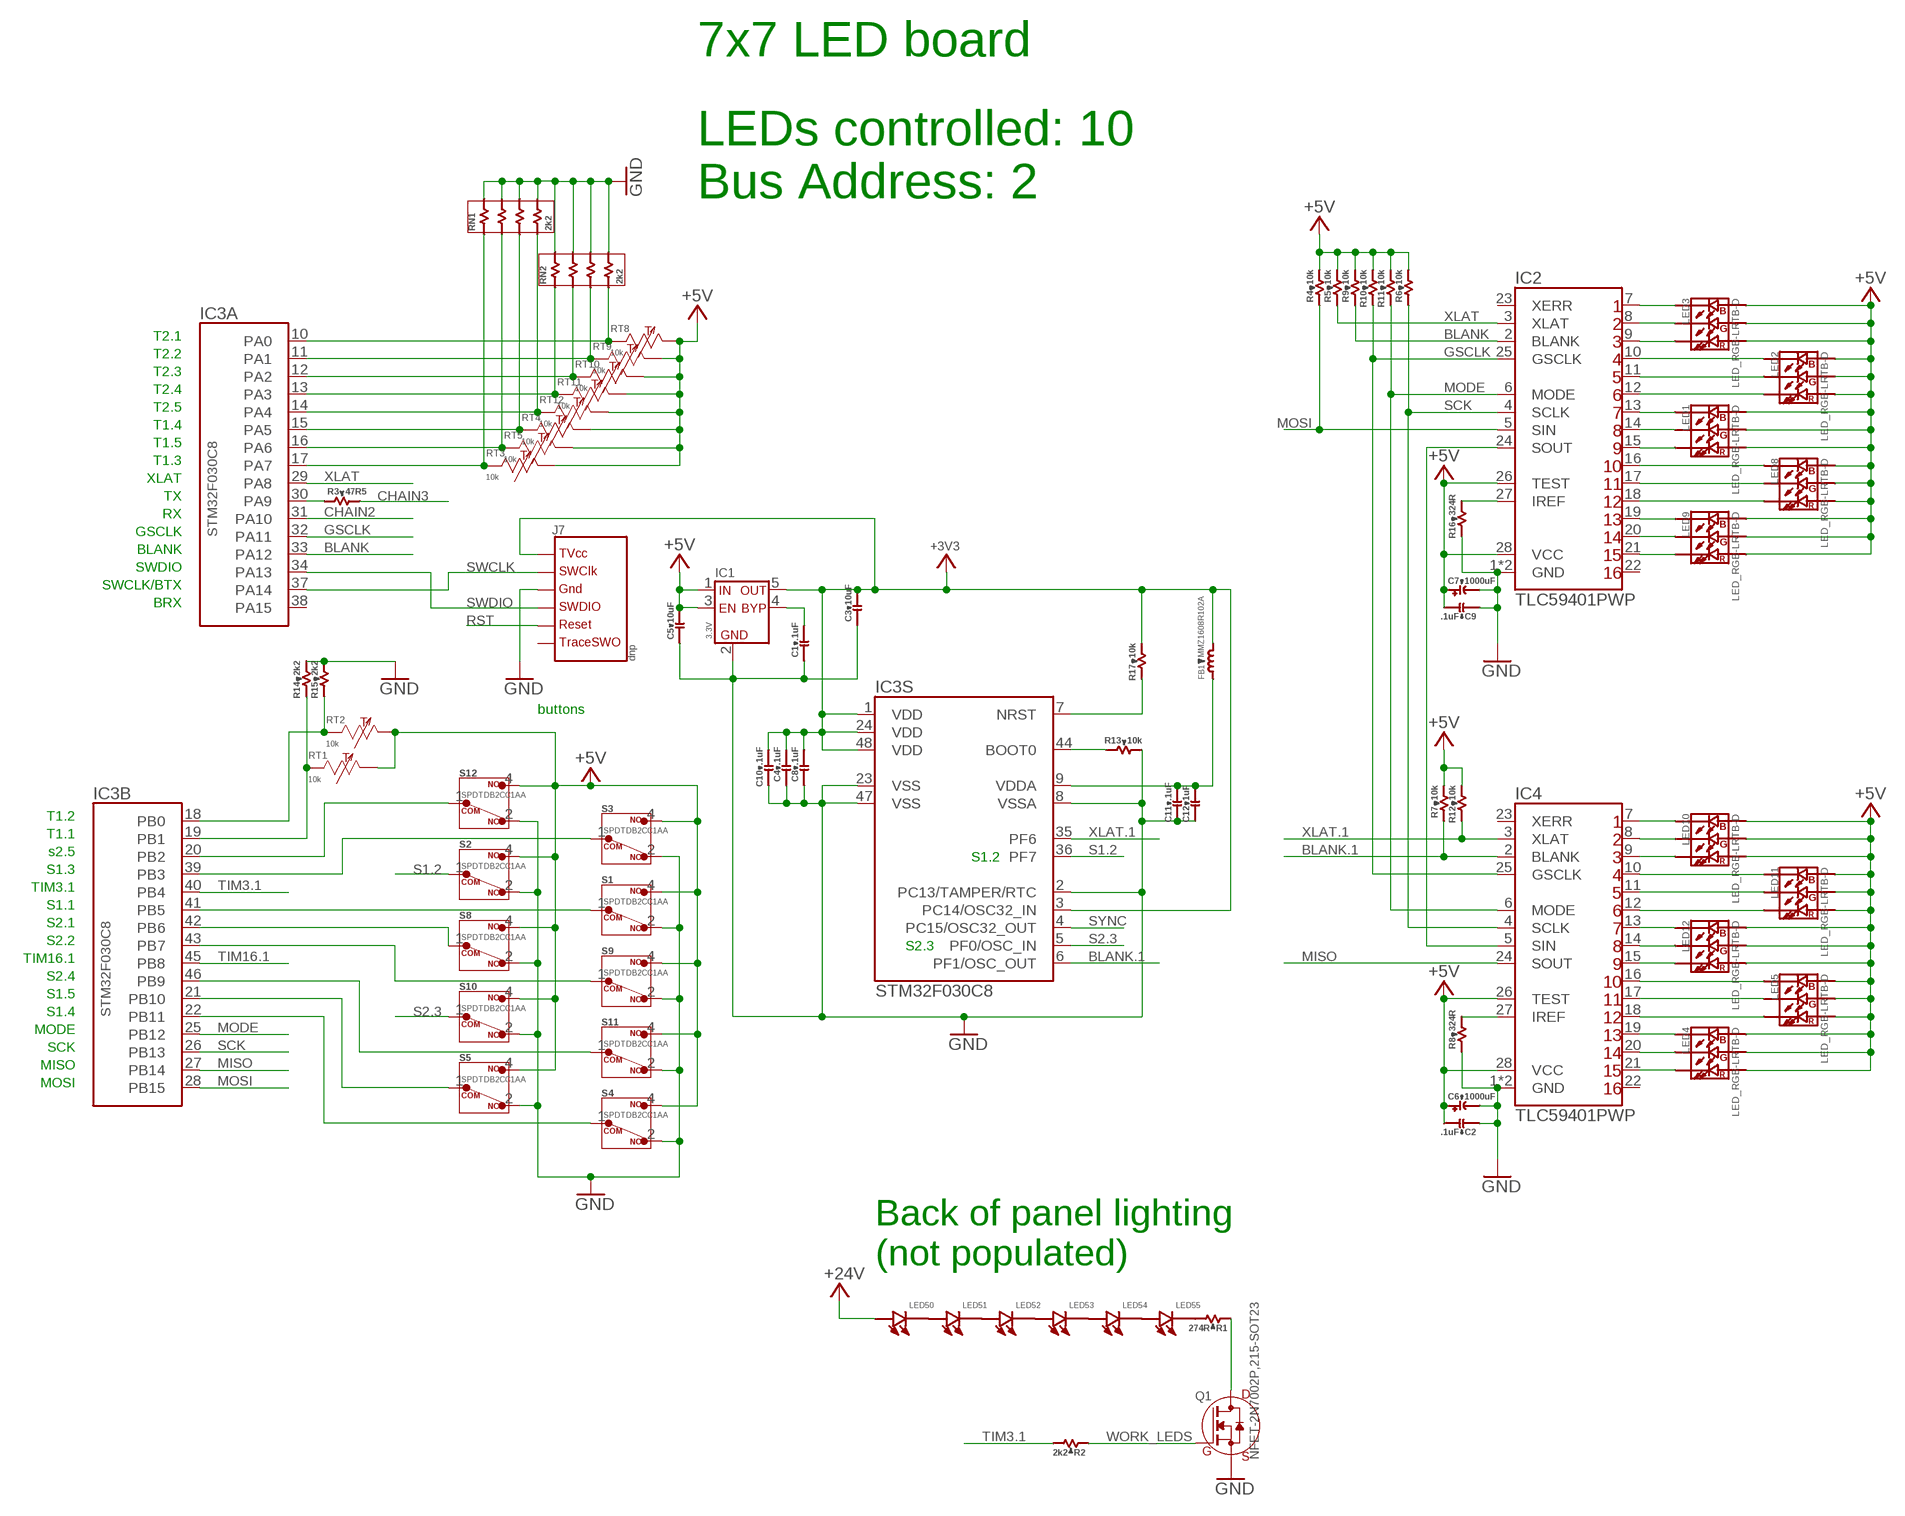
[diagram p3: schematic, sheet 4]

### Parts
C1  .1uF  C0603  [C0603B]
C2  .1uF  C0603  [C0603B]
C3  10uF  C0603  [C0603B]
C4  .1uF  C0603  [C0603B]
C5  10uF  C0603  [C0603B]
C6  1000uF  CPOL-TH-5-10.5  [E5-10,5]
C7  1000uF  CPOL-TH-5-10.5  [E5-10,5]
C8  .1uF  C0603  [C0603B]
C9  .1uF  C0603  [C0603B]
C10  .1uF  C0603  [C0603B]
C11  .1uF  C0603  [C0603B]
C12  1uF  C0603  [C0603B]
FB1  MMZ1608R102A  FB0603  [R0603B]
IC1  3.3V  TC2185  [SOT-23-5]
IC2  TLC59401PWP  [TSSOP28_PAD]
IC3  STM32F030C8  [LQFP-48]
IC4  TLC59401PWP  [TSSOP28_PAD]
J7  dnp  STM32-SW-TC2030  [TC2030-IDC-NL]
LED1  LED_RGB-LRTB-D  [LRTB_C9TP-D]
LED2  LED_RGB-LRTB-D  [LRTB_C9TP-D]
LED3  LED_RGB-LRTB-D  [LRTB_C9TP-D]
LED4  LED_RGB-LRTB-D  [LRTB_C9TP-D]
LED5  LED_RGB-LRTB-D  [LRTB_C9TP-D]
LED8  LED_RGB-LRTB-D  [LRTB_C9TP-D]
LED9  LED_RGB-LRTB-D  [LRTB_C9TP-D]
LED10  LED_RGB-LRTB-D  [LRTB_C9TP-D]
LED11  LED_RGB-LRTB-D  [LRTB_C9TP-D]
LED12  LED_RGB-LRTB-D  [LRTB_C9TP-D]
LED50  LED-LTW-006DCG  [LTW-006DCG]
LED51  LED-LTW-006DCG  [LTW-006DCG]
LED52  LED-LTW-006DCG  [LTW-006DCG]
LED53  LED-LTW-006DCG  [LTW-006DCG]
LED54  LED-LTW-006DCG  [LTW-006DCG]
LED55  LED-LTW-006DCG  [LTW-006DCG]
Q1  NFET-2N7002P,215-SOT23  [SOT-23]
R1  274R  R0805  [R0805B]
R2  2k2  R0603  [R0603B]
R3  47R5  R0603  [R0603B]
R4  10k  R0603  [R0603B]
R5  10k  R0603  [R0603B]
R6  10k  R0603  [R0603B]
R7  10k  R0603  [R0603B]
R8  324R  R0603  [R0603B]
R9  10k  R0603  [R0603B]
R10  10k  R0603  [R0603B]
R11  10k  R0603  [R0603B]
R12  10k  R0603  [R0603B]
R13  10k  R0603  [R0603B]
R14  2k2  R0603  [R0603B]
R15  2k2  R0603  [R0603B]
R16  324R  R0603  [R0603B]
R17  10k  R0603  [R0603B]
RN1  2k2  R4_CAY16  [CAY16]
RN2  2k2  R4_CAY16  [CAY16]
RT1  10k  RT0603  [R0603Y]
RT2  10k  RT0603  [R0603Y]
RT3  10k  RT0603  [R0603Y]
RT4  10k  RT0603  [R0603Y]
RT5  10k  RT0603  [R0603Y]
RT8  10k  RT0603  [R0603Y]
RT9  10k  RT0603  [R0603Y]
RT10  10k  RT0603  [R0603Y]
RT11  10k  RT0603  [R0603Y]
RT12  10k  RT0603  [R0603Y]
S1  SPDTDB2CC1AA  [DB2CC1AA]
S2  SPDTDB2CC1AA  [DB2CC1AA]
S3  SPDTDB2CC1AA  [DB2CC1AA]
S4  SPDTDB2CC1AA  [DB2CC1AA]
S5  SPDTDB2CC1AA  [DB2CC1AA]
S8  SPDTDB2CC1AA  [DB2CC1AA]
S9  SPDTDB2CC1AA  [DB2CC1AA]
S10  SPDTDB2CC1AA  [DB2CC1AA]
S11  SPDTDB2CC1AA  [DB2CC1AA]
S12  SPDTDB2CC1AA  [DB2CC1AA]

### Nets
+3V3: C3.2 C4.2 C8.2 C10.2 FB1.2 IC1.5(OUT) IC3.1(S:VDD) IC3.3(S:PC14/OSC32_IN) IC3.24(S:VDD) IC3.48(S:VDD) J7.1(TVCC) R17.2
+5V: C2.2 C5.2 C6.+ C7.+ C9.2 IC1.1(IN) IC1.3(EN) IC2.26(TEST) IC2.28(VCC) IC4.26(TEST) IC4.28(VCC) LED1.A1(ANODE_R) LED1.A2(ANODE_G) LED1.A3(ANODE_B) LED2.A1(ANODE_R) LED2.A2(ANODE_G) LED2.A3(ANODE_B) LED3.A1(ANODE_R) LED3.A2(ANODE_G) LED3.A3(ANODE_B) LED4.A1(ANODE_R) LED4.A2(ANODE_G) LED4.A3(ANODE_B) LED5.A1(ANODE_R) LED5.A2(ANODE_G) LED5.A3(ANODE_B) LED8.A1(ANODE_R) LED8.A2(ANODE_G) LED8.A3(ANODE_B) LED9.A1(ANODE_R) LED9.A2(ANODE_G) LED9.A3(ANODE_B) LED10.A1(ANODE_R) LED10.A2(ANODE_G) LED10.A3(ANODE_B) LED11.A1(ANODE_R) LED11.A2(ANODE_G) LED11.A3(ANODE_B) LED12.A1(ANODE_R) LED12.A2(ANODE_G) LED12.A3(ANODE_B) R4.2 R5.2 R6.2 R7.2 R9.2 R10.2 R11.2 R12.2 RT1.2 RT2.2 RT3.2 RT4.2 RT5.2 RT8.2 RT9.2 RT10.2 RT11.2 RT12.2 S1.4(NO) S2.4(NO) S3.4(NO) S4.4(NO) S5.4(NO) S8.4(NO) S9.4(NO) S10.4(NO) S11.4(NO) S12.4(NO) ; also sheet 1,5,7
+24V: LED50.A(ANODE) ; also sheet 1,7,8,9
BLANK: IC2.2(BLANK) IC3.33(A:PA12) R9.1
BLANK.1: IC3.6(S:PF1/OSC_OUT) IC4.2(BLANK) R7.1
CHAIN2: IC3.31(A:PA10) ; also sheet 3
CHAIN3: R3.2 ; also sheet 5
GND: C1.1 C2.1 C3.1 C4.1 C5.1 C6.- C7.- C8.1 C9.1 C10.1 C11.1 C12.1 IC1.2(GND) IC2.1(GND) IC2.PAD(GND) IC3.2(S:PC13/TAMPER/RTC) IC3.8(S:VSSA) IC3.23(S:VSS) IC3.47(S:VSS) IC4.1(GND) IC4.PAD(GND) J7.5(GND) Q1.2(S) R8.1 R13.2 R14.2 R15.2 R16.1 RN1.A2 RN1.B2 RN1.C2 RN1.D2 RN2.A2 RN2.B2 RN2.C2 RN2.D2 S1.2(NC) S2.2(NC) S3.2(NC) S4.2(NC) S5.2(NC) S8.2(NC) S9.2(NC) S10.2(NC) S11.2(NC) S12.2(NC) ; also sheet 1,2,3,5,6,7,8,9
GSCLK: IC2.25(GSCLK) IC3.32(A:PA11) IC4.25(GSCLK) R10.1
MISO: IC3.27(B:PB14) IC4.24(SOUT)
MODE: IC2.6(MODE) IC3.25(B:PB12) IC4.6(MODE) R11.1
MOSI: IC2.5(SIN) IC3.28(B:PB15) R4.1
N$1: IC3.44(S:BOOT0) R13.1
N$3: IC2.7(OUT1) LED3.C3(CATHODE_B)
N$4: C1.2 IC1.4(BYPASS)
N$5: C11.2 C12.2 FB1.1 IC3.9(S:VDDA)
N$6: IC2.8(OUT2) LED3.C2(CATHODE_G)
N$7: IC2.24(SOUT) IC4.5(SIN)
N$8: IC2.9(OUT3) LED3.C1(CATHODE_R)
N$9: IC2.10(OUT4) LED2.C3(CATHODE_B)
N$10: IC2.11(OUT5) LED2.C2(CATHODE_G)
N$11: IC2.12(OUT6) LED2.C1(CATHODE_R)
N$12: IC2.13(OUT7) LED1.C3(CATHODE_B)
N$13: IC4.27(IREF) R8.2
N$14: IC2.14(OUT8) LED1.C2(CATHODE_G)
N$15: IC2.15(OUT9) LED1.C1(CATHODE_R)
N$16: IC2.27(IREF) R16.2
N$17: IC2.16(OUT10) LED8.C3(CATHODE_B)
N$18: IC2.17(OUT11) LED8.C2(CATHODE_G)
N$19: IC2.18(OUT12) LED8.C1(CATHODE_R)
N$20: IC2.19(OUT13) LED9.C3(CATHODE_B)
N$21: IC2.20(OUT14) LED9.C2(CATHODE_G)
N$22: IC2.21(OUT15) LED9.C1(CATHODE_R)
N$25: IC4.7(OUT1) LED10.C3(CATHODE_B)
N$26: IC4.8(OUT2) LED10.C2(CATHODE_G)
N$27: IC4.9(OUT3) LED10.C1(CATHODE_R)
N$28: IC4.10(OUT4) LED11.C3(CATHODE_B)
N$29: IC4.11(OUT5) LED11.C2(CATHODE_G)
N$30: IC4.12(OUT6) LED11.C1(CATHODE_R)
N$31: IC4.13(OUT7) LED12.C3(CATHODE_B)
N$32: IC4.14(OUT8) LED12.C2(CATHODE_G)
N$33: IC4.15(OUT9) LED12.C1(CATHODE_R)
N$34: IC4.16(OUT10) LED5.C3(CATHODE_B)
N$35: IC4.17(OUT11) LED5.C2(CATHODE_G)
N$36: IC4.18(OUT12) LED5.C1(CATHODE_R)
N$37: IC4.19(OUT13) LED4.C3(CATHODE_B)
N$38: IC4.20(OUT14) LED4.C2(CATHODE_G)
N$39: IC4.21(OUT15) LED4.C1(CATHODE_R)
N$190: IC3.30(A:PA9) R3.1
N$195: Q1.3(D) R1.1
N$196: LED55.K(CATHODE) R1.2
N$197: LED54.K(CATHODE) LED55.A(ANODE)
N$198: LED53.K(CATHODE) LED54.A(ANODE)
N$199: LED52.K(CATHODE) LED53.A(ANODE)
N$200: LED51.K(CATHODE) LED52.A(ANODE)
N$201: LED50.K(CATHODE) LED51.A(ANODE)
RST: IC3.7(S:NRST) J7.3(RESET) R17.1
S1.1: IC3.41(B:PB5) S1.1(COM)
S1.2: IC3.36(S:PF7) S2.1(COM)
S1.3: IC3.39(B:PB3) S3.1(COM)
S1.4: IC3.22(B:PB11) S4.1(COM)
S1.5: IC3.21(B:PB10) S5.1(COM)
S2.1: IC3.42(B:PB6) S8.1(COM)
S2.2: IC3.43(B:PB7) S9.1(COM)
S2.3: IC3.5(S:PF0/OSC_IN) S10.1(COM)
S2.4: IC3.46(B:PB9) S11.1(COM)
S2.5: IC3.20(B:PB2) S12.1(COM)
SCK: IC2.4(SCLK) IC3.26(B:PB13) IC4.4(SCLK) R6.1
SWCLK: IC3.37(A:PA14) J7.4(SWCLK)
SWDIO: IC3.34(A:PA13) J7.2(SWDIO)
SYNC: IC3.4(S:PC15/OSC32_OUT) ; also sheet 2,3,5,6
T1: IC3.10(A:PA0) RN2.D1 RT8.1
T2: IC3.11(A:PA1) RN2.C1 RT9.1
T3: IC3.12(A:PA2) RN2.B1 RT10.1
T4: IC3.13(A:PA3) RN2.A1 RT11.1
T5: IC3.14(A:PA4) RN1.D1 RT12.1
T6: IC3.15(A:PA5) RN1.C1 RT4.1
T7: IC3.16(A:PA6) RN1.B1 RT5.1
T8: IC3.17(A:PA7) RN1.A1 RT3.1
T9: IC3.18(B:PB0) R15.1 RT2.1
T10: IC3.19(B:PB1) R14.1 RT1.1
TIM3.1: IC3.40(B:PB4) R2.2
TIM16.1: IC3.45(B:PB8)
WORK_LEDS: Q1.1(G) R2.1
XLAT: IC2.3(XLAT) IC3.29(A:PA8) R5.1
XLAT.1: IC3.35(S:PF6) IC4.3(XLAT) R12.1
Unconnected: IC2.22(OUT16) IC2.23(XERR) IC3.38(A:PA15) IC4.22(OUT16) IC4.23(XERR) J7.6(TRACESWO)

### Notes on the sheet
- 7x7 LED board
- LEDs controlled: 10
  Bus Address: 2
- T2.1
- T2.2
- T2.3
- T2.4
- T2.5
- T1.4
- T1.5
- T1.3
- XLAT
- TX
- RX
- GSCLK
- BLANK
- SWDIO
- SWCLK/BTX
- BRX
- buttons
- T1.2
- T1.1
- s2.5
- S1.2
- S1.3
- TIM3.1
- S1.1
- S2.1
- S2.2
- S2.3
- TIM16.1
- S2.4
- S1.5
- S1.4
- MODE
- SCK
- MISO
- MOSI
- Back of panel lighting
  (not populated)

## Sheet 5 of 9
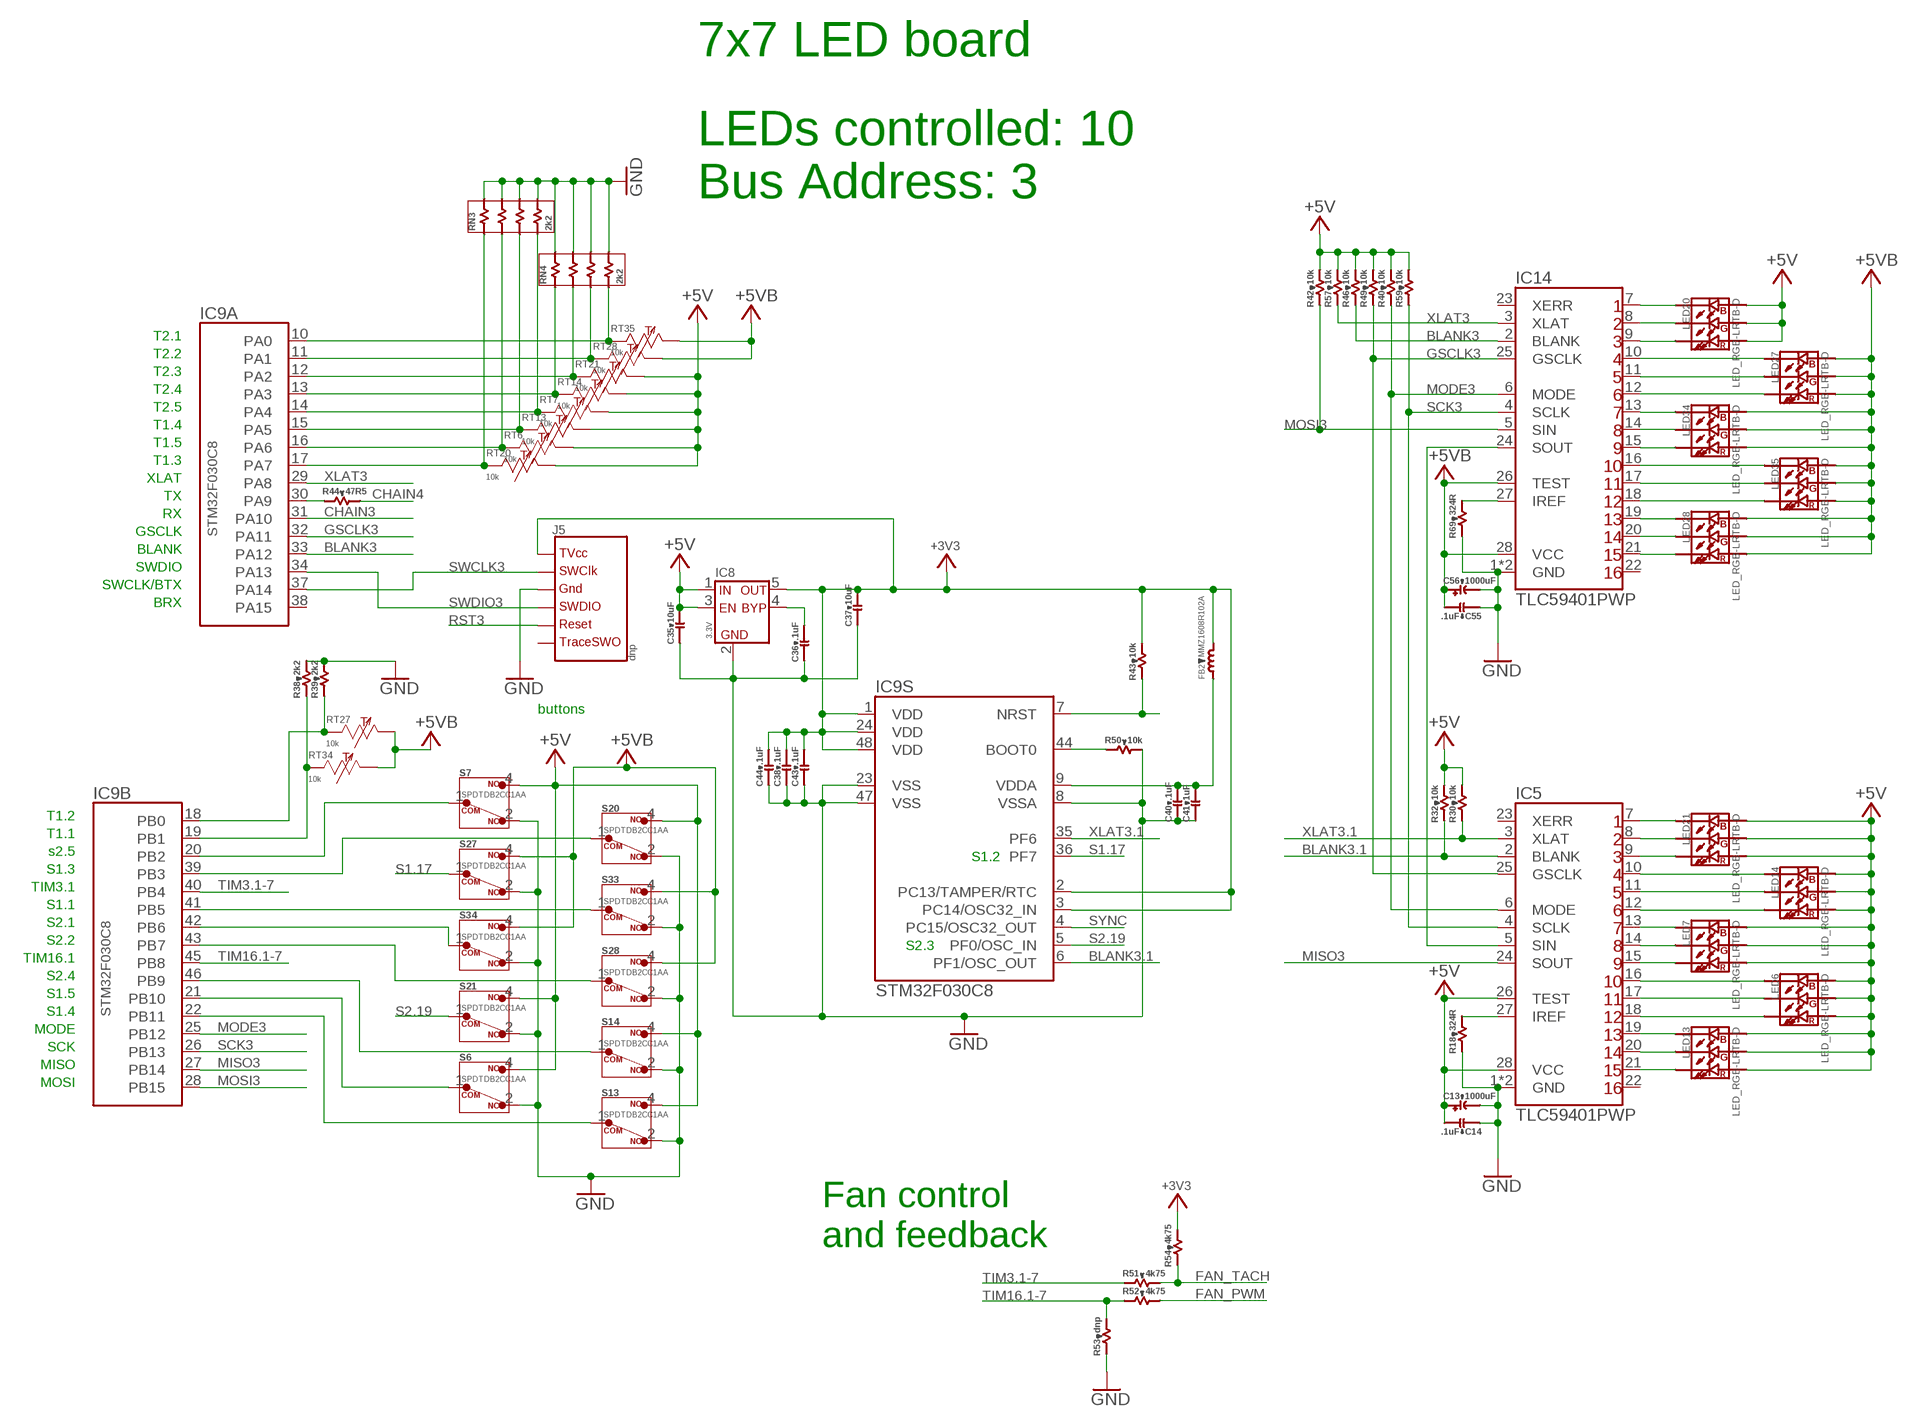
[diagram p4: schematic, sheet 5]

### Parts
C13  1000uF  CPOL-TH-5-10.5  [E5-10,5]
C14  .1uF  C0603  [C0603B]
C35  10uF  C0603  [C0603B]
C36  .1uF  C0603  [C0603B]
C37  10uF  C0603  [C0603B]
C38  .1uF  C0603  [C0603B]
C40  .1uF  C0603  [C0603B]
C41  1uF  C0603  [C0603B]
C43  .1uF  C0603  [C0603B]
C44  .1uF  C0603  [C0603B]
C55  .1uF  C0603  [C0603B]
C56  1000uF  CPOL-TH-5-10.5  [E5-10,5]
FB2  MMZ1608R102A  FB0603  [R0603B]
IC5  TLC59401PWP  [TSSOP28_PAD]
IC8  3.3V  TC2185  [SOT-23-5]
IC9  STM32F030C8  [LQFP-48]
IC14  TLC59401PWP  [TSSOP28_PAD]
J5  dnp  STM32-SW-TC2030  [TC2030-IDC-NL]
LED6  LED_RGB-LRTB-D  [LRTB_C9TP-D]
LED7  LED_RGB-LRTB-D  [LRTB_C9TP-D]
LED13  LED_RGB-LRTB-D  [LRTB_C9TP-D]
LED14  LED_RGB-LRTB-D  [LRTB_C9TP-D]
LED20  LED_RGB-LRTB-D  [LRTB_C9TP-D]
LED21  LED_RGB-LRTB-D  [LRTB_C9TP-D]
LED27  LED_RGB-LRTB-D  [LRTB_C9TP-D]
LED28  LED_RGB-LRTB-D  [LRTB_C9TP-D]
LED34  LED_RGB-LRTB-D  [LRTB_C9TP-D]
LED35  LED_RGB-LRTB-D  [LRTB_C9TP-D]
R18  324R  R0603  [R0603B]
R30  10k  R0603  [R0603B]
R32  10k  R0603  [R0603B]
R38  2k2  R0603  [R0603B]
R39  2k2  R0603  [R0603B]
R40  10k  R0603  [R0603B]
R42  10k  R0603  [R0603B]
R43  10k  R0603  [R0603B]
R44  47R5  R0603  [R0603B]
R46  10k  R0603  [R0603B]
R49  10k  R0603  [R0603B]
R50  10k  R0603  [R0603B]
R51  4k75  R0603  [R0603B]
R52  4k75  R0603  [R0603B]
R53  dnp  R0603  [R0603B]
R54  4k75  R0603  [R0603B]
R57  10k  R0603  [R0603B]
R59  10k  R0603  [R0603B]
R69  324R  R0603  [R0603B]
RN3  2k2  R4_CAY16  [CAY16]
RN4  2k2  R4_CAY16  [CAY16]
RT6  10k  RT0603  [R0603Y]
RT7  10k  RT0603  [R0603Y]
RT13  10k  RT0603  [R0603Y]
RT14  10k  RT0603  [R0603Y]
RT20  10k  RT0603  [R0603Y]
RT21  10k  RT0603  [R0603Y]
RT27  10k  RT0603  [R0603Y]
RT28  10k  RT0603  [R0603Y]
RT34  10k  RT0603  [R0603Y]
RT35  10k  RT0603  [R0603Y]
S6  SPDTDB2CC1AA  [DB2CC1AA]
S7  SPDTDB2CC1AA  [DB2CC1AA]
S13  SPDTDB2CC1AA  [DB2CC1AA]
S14  SPDTDB2CC1AA  [DB2CC1AA]
S20  SPDTDB2CC1AA  [DB2CC1AA]
S21  SPDTDB2CC1AA  [DB2CC1AA]
S27  SPDTDB2CC1AA  [DB2CC1AA]
S28  SPDTDB2CC1AA  [DB2CC1AA]
S33  SPDTDB2CC1AA  [DB2CC1AA]
S34  SPDTDB2CC1AA  [DB2CC1AA]

### Nets
+3V3.D: C37.2 C38.2 C43.2 C44.2 FB2.2 IC8.5(OUT) IC9.1(S:VDD) IC9.2(S:PC13/TAMPER/RTC) IC9.3(S:PC14/OSC32_IN) IC9.24(S:VDD) IC9.48(S:VDD) J5.1(TVCC) R43.2 R54.2 ; supply symbol labelled +3V3
+5V: C13.+ C14.2 C35.2 IC5.26(TEST) IC5.28(VCC) IC8.1(IN) IC8.3(EN) LED6.A1(ANODE_R) LED6.A2(ANODE_G) LED6.A3(ANODE_B) LED7.A1(ANODE_R) LED7.A2(ANODE_G) LED7.A3(ANODE_B) LED13.A1(ANODE_R) LED13.A2(ANODE_G) LED13.A3(ANODE_B) LED14.A1(ANODE_R) LED14.A2(ANODE_G) LED14.A3(ANODE_B) LED20.A1(ANODE_R) LED20.A2(ANODE_G) LED20.A3(ANODE_B) LED21.A1(ANODE_R) LED21.A2(ANODE_G) LED21.A3(ANODE_B) R30.2 R32.2 R40.2 R42.2 R46.2 R49.2 R57.2 R59.2 RT6.2 RT7.2 RT13.2 RT14.2 RT20.2 RT21.2 S6.4(NO) S7.4(NO) S13.4(NO) S14.4(NO) S20.4(NO) S21.4(NO) ; also sheet 1,4,7
+5VB: C55.2 C56.+ IC14.26(TEST) IC14.28(VCC) LED27.A1(ANODE_R) LED27.A2(ANODE_G) LED27.A3(ANODE_B) LED28.A1(ANODE_R) LED28.A2(ANODE_G) LED28.A3(ANODE_B) LED34.A1(ANODE_R) LED34.A2(ANODE_G) LED34.A3(ANODE_B) LED35.A1(ANODE_R) LED35.A2(ANODE_G) LED35.A3(ANODE_B) RT27.2 RT28.2 RT34.2 RT35.2 S27.4(NO) S28.4(NO) S33.4(NO) S34.4(NO) ; also sheet 1,2,6,8
BLANK3: IC9.33(A:PA12) IC14.2(BLANK) R46.1
BLANK3.1: IC5.2(BLANK) IC9.6(S:PF1/OSC_OUT) R32.1
CHAIN3: IC9.31(A:PA10) ; also sheet 4
CHAIN4: R44.2 ; also sheet 6
FAN_PWM: R52.2 ; also sheet 1
FAN_TACH: R51.2 R54.1 ; also sheet 1
GND: C13.- C14.1 C35.1 C36.1 C37.1 C38.1 C40.1 C41.1 C43.1 C44.1 C55.1 C56.- IC5.1(GND) IC5.PAD(GND) IC8.2(GND) IC9.8(S:VSSA) IC9.23(S:VSS) IC9.47(S:VSS) IC14.1(GND) IC14.PAD(GND) J5.5(GND) R18.1 R38.2 R39.2 R50.2 R53.1 R69.1 RN3.A2 RN3.B2 RN3.C2 RN3.D2 RN4.A2 RN4.B2 RN4.C2 RN4.D2 S6.2(NC) S7.2(NC) S13.2(NC) S14.2(NC) S20.2(NC) S21.2(NC) S27.2(NC) S28.2(NC) S33.2(NC) S34.2(NC) ; also sheet 1,2,3,4,6,7,8,9
GSCLK3: IC5.25(GSCLK) IC9.32(A:PA11) IC14.25(GSCLK) R49.1
MISO3: IC5.24(SOUT) IC9.27(B:PB14)
MODE3: IC5.6(MODE) IC9.25(B:PB12) IC14.6(MODE) R40.1
MOSI3: IC9.28(B:PB15) IC14.5(SIN) R42.1
N$109: IC9.44(S:BOOT0) R50.1
N$110: C40.2 C41.2 FB2.1 IC9.9(S:VDDA)
N$111: C36.2 IC8.4(BYPASS)
N$112: IC5.5(SIN) IC14.24(SOUT)
N$113: IC5.27(IREF) R18.2
N$114: IC14.27(IREF) R69.2
N$115: IC14.7(OUT1) LED20.C3(CATHODE_B)
N$116: IC14.8(OUT2) LED20.C2(CATHODE_G)
N$117: IC14.9(OUT3) LED20.C1(CATHODE_R)
N$118: IC14.10(OUT4) LED27.C3(CATHODE_B)
N$119: IC14.11(OUT5) LED27.C2(CATHODE_G)
N$120: IC14.12(OUT6) LED27.C1(CATHODE_R)
N$121: IC14.13(OUT7) LED34.C3(CATHODE_B)
N$122: IC14.14(OUT8) LED34.C2(CATHODE_G)
N$123: IC14.15(OUT9) LED34.C1(CATHODE_R)
N$124: IC14.16(OUT10) LED35.C3(CATHODE_B)
N$125: IC14.17(OUT11) LED35.C2(CATHODE_G)
N$126: IC14.18(OUT12) LED35.C1(CATHODE_R)
N$127: IC14.19(OUT13) LED28.C3(CATHODE_B)
N$128: IC14.20(OUT14) LED28.C2(CATHODE_G)
N$129: IC14.21(OUT15) LED28.C1(CATHODE_R)
N$130: IC5.7(OUT1) LED21.C3(CATHODE_B)
N$131: IC5.8(OUT2) LED21.C2(CATHODE_G)
N$132: IC5.9(OUT3) LED21.C1(CATHODE_R)
N$133: IC5.10(OUT4) LED14.C3(CATHODE_B)
N$134: IC5.11(OUT5) LED14.C2(CATHODE_G)
N$135: IC5.12(OUT6) LED14.C1(CATHODE_R)
N$136: IC5.13(OUT7) LED7.C3(CATHODE_B)
N$137: IC5.14(OUT8) LED7.C2(CATHODE_G)
N$138: IC5.15(OUT9) LED7.C1(CATHODE_R)
N$139: IC5.16(OUT10) LED6.C3(CATHODE_B)
N$140: IC5.17(OUT11) LED6.C2(CATHODE_G)
N$141: IC5.18(OUT12) LED6.C1(CATHODE_R)
N$142: IC5.19(OUT13) LED13.C3(CATHODE_B)
N$143: IC5.20(OUT14) LED13.C2(CATHODE_G)
N$144: IC5.21(OUT15) LED13.C1(CATHODE_R)
N$193: IC9.30(A:PA9) R44.1
RST3: IC9.7(S:NRST) J5.3(RESET) R43.1
S1.16: IC9.39(B:PB3) S20.1(COM)
S1.17: IC9.36(S:PF7) S27.1(COM)
S1.18: IC9.41(B:PB5) S33.1(COM)
S1.19: IC9.21(B:PB10) S6.1(COM)
S1.20: IC9.22(B:PB11) S13.1(COM)
S2.16: IC9.20(B:PB2) S7.1(COM)
S2.17: IC9.42(B:PB6) S34.1(COM)
S2.18: IC9.43(B:PB7) S28.1(COM)
S2.19: IC9.5(S:PF0/OSC_IN) S21.1(COM)
S2.20: IC9.46(B:PB9) S14.1(COM)
SCK3: IC5.4(SCLK) IC9.26(B:PB13) IC14.4(SCLK) R59.1
SWCLK3: IC9.37(A:PA14) J5.4(SWCLK)
SWDIO3: IC9.34(A:PA13) J5.2(SWDIO)
SYNC: IC9.4(S:PC15/OSC32_OUT) ; also sheet 2,3,4,6
T31: IC9.14(A:PA4) RN3.D1 RT7.1
T32: IC9.15(A:PA5) RN3.C1 RT13.1
T33: IC9.16(A:PA6) RN3.B1 RT6.1
T34: IC9.17(A:PA7) RN3.A1 RT20.1
T35: IC9.18(B:PB0) R39.1 RT27.1
T36: IC9.19(B:PB1) R38.1 RT34.1
T37: IC9.13(A:PA3) RN4.A1 RT14.1
T38: IC9.12(A:PA2) RN4.B1 RT21.1
T39: IC9.11(A:PA1) RN4.C1 RT28.1
T40: IC9.10(A:PA0) RN4.D1 RT35.1
TIM3.1-7: IC9.40(B:PB4) R51.1
TIM16.1-7: IC9.45(B:PB8) R52.1 R53.2
XLAT3: IC9.29(A:PA8) IC14.3(XLAT) R57.1
XLAT3.1: IC5.3(XLAT) IC9.35(S:PF6) R30.1
Unconnected: IC5.22(OUT16) IC5.23(XERR) IC9.38(A:PA15) IC14.22(OUT16) IC14.23(XERR) J5.6(TRACESWO)

### Notes on the sheet
- 7x7 LED board
- LEDs controlled: 10
  Bus Address: 3
- T2.1
- T2.2
- T2.3
- T2.4
- T2.5
- T1.4
- T1.5
- T1.3
- XLAT
- TX
- RX
- GSCLK
- BLANK
- SWDIO
- SWCLK/BTX
- BRX
- buttons
- T1.2
- T1.1
- s2.5
- S1.2
- S1.3
- TIM3.1
- S1.1
- S2.1
- S2.2
- S2.3
- TIM16.1
- S2.4
- S1.5
- S1.4
- MODE
- SCK
- MISO
- MOSI
- Fan control
  and feedback

## Sheet 6 of 9
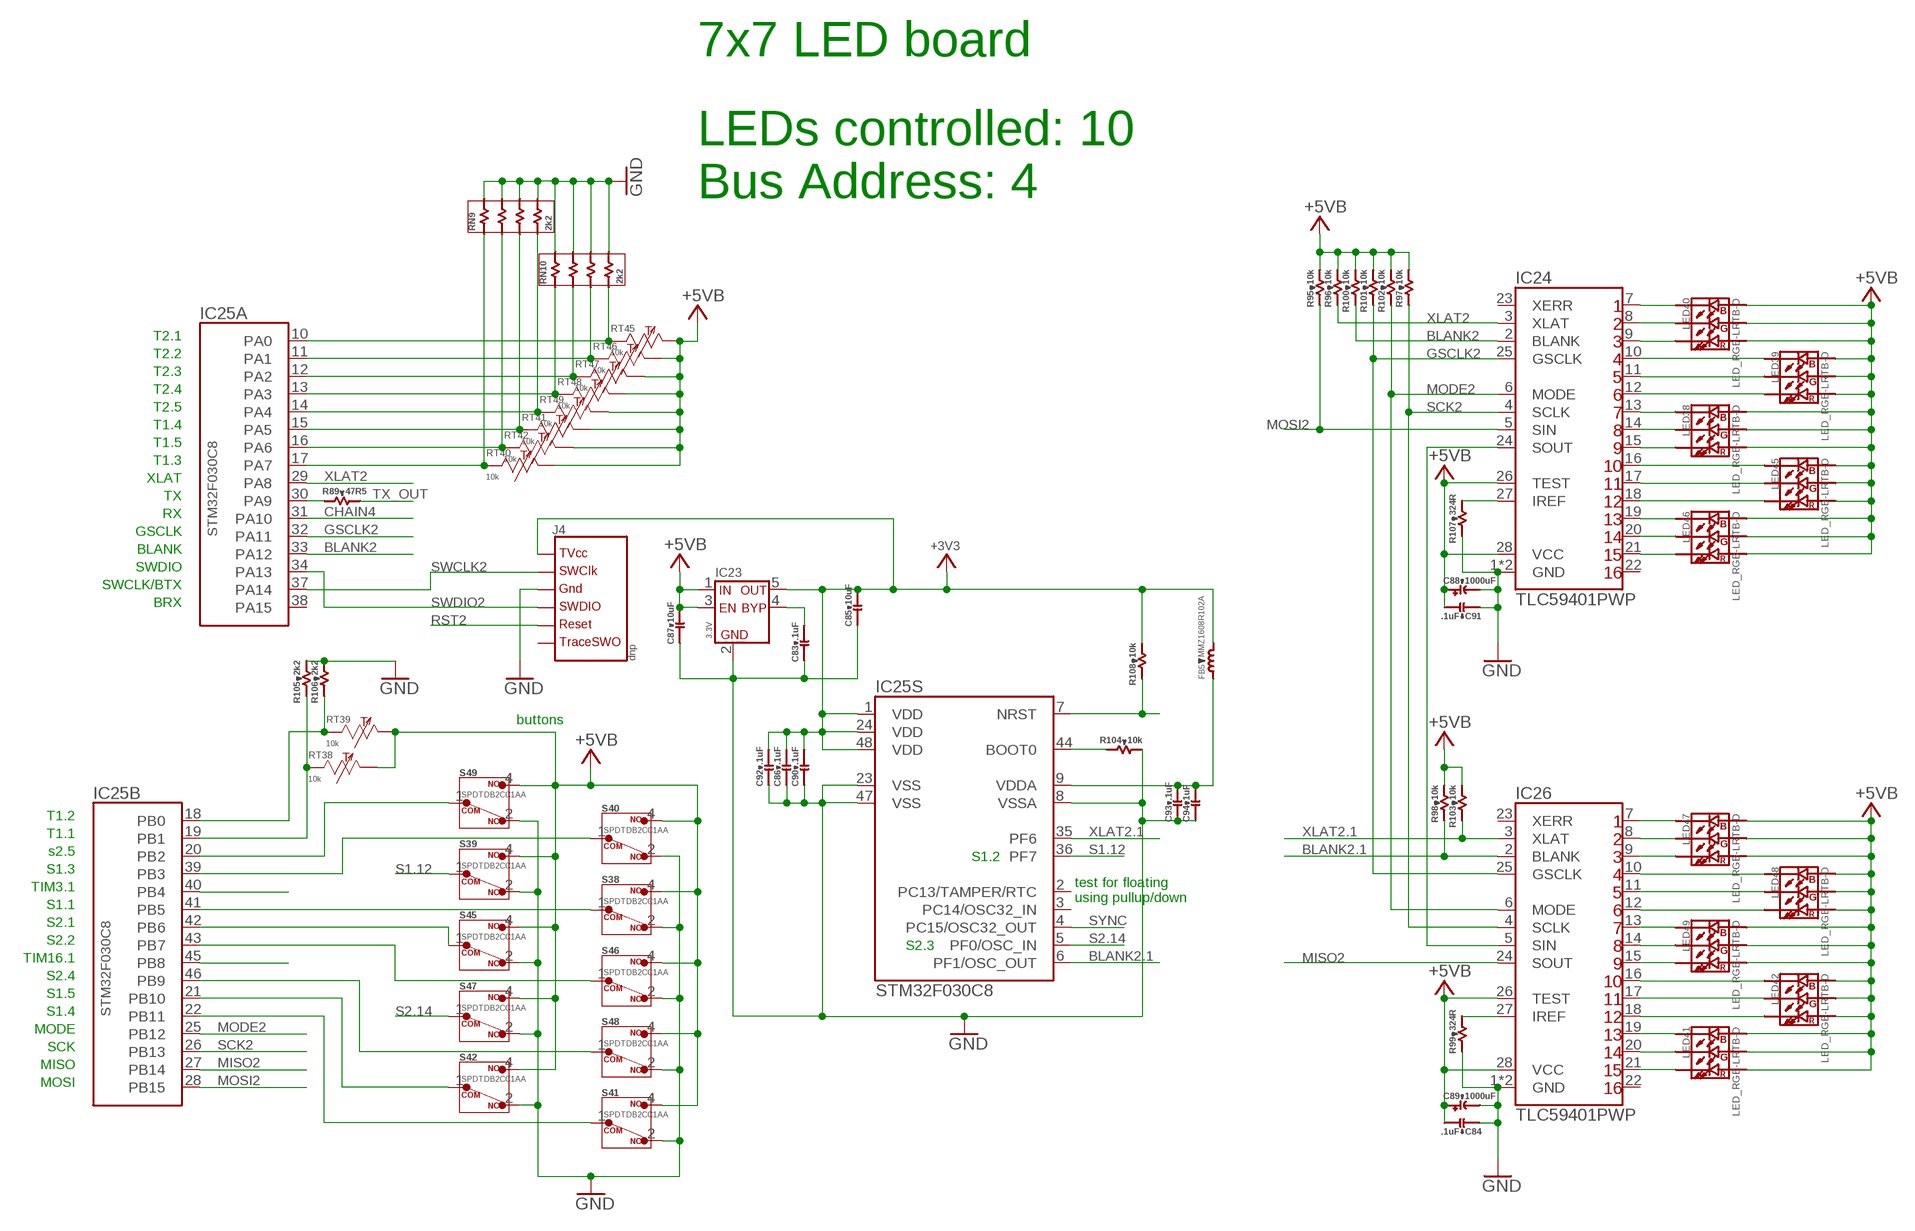
[diagram p5: schematic, sheet 6]

### Parts
C83  .1uF  C0603  [C0603B]
C84  .1uF  C0603  [C0603B]
C85  10uF  C0603  [C0603B]
C86  .1uF  C0603  [C0603B]
C87  10uF  C0603  [C0603B]
C88  1000uF  CPOL-TH-5-10.5  [E5-10,5]
C89  1000uF  CPOL-TH-5-10.5  [E5-10,5]
C90  .1uF  C0603  [C0603B]
C91  .1uF  C0603  [C0603B]
C92  .1uF  C0603  [C0603B]
C93  .1uF  C0603  [C0603B]
C94  1uF  C0603  [C0603B]
FB5  MMZ1608R102A  FB0603  [R0603B]
IC23  3.3V  TC2185  [SOT-23-5]
IC24  TLC59401PWP  [TSSOP28_PAD]
IC25  STM32F030C8  [LQFP-48]
IC26  TLC59401PWP  [TSSOP28_PAD]
J4  dnp  STM32-SW-TC2030  [TC2030-IDC-NL]
LED38  LED_RGB-LRTB-D  [LRTB_C9TP-D]
LED39  LED_RGB-LRTB-D  [LRTB_C9TP-D]
LED40  LED_RGB-LRTB-D  [LRTB_C9TP-D]
LED41  LED_RGB-LRTB-D  [LRTB_C9TP-D]
LED42  LED_RGB-LRTB-D  [LRTB_C9TP-D]
LED45  LED_RGB-LRTB-D  [LRTB_C9TP-D]
LED46  LED_RGB-LRTB-D  [LRTB_C9TP-D]
LED47  LED_RGB-LRTB-D  [LRTB_C9TP-D]
LED48  LED_RGB-LRTB-D  [LRTB_C9TP-D]
LED49  LED_RGB-LRTB-D  [LRTB_C9TP-D]
R89  47R5  R0603  [R0603B]
R95  10k  R0603  [R0603B]
R96  10k  R0603  [R0603B]
R97  10k  R0603  [R0603B]
R98  10k  R0603  [R0603B]
R99  324R  R0603  [R0603B]
R100  10k  R0603  [R0603B]
R101  10k  R0603  [R0603B]
R102  10k  R0603  [R0603B]
R103  10k  R0603  [R0603B]
R104  10k  R0603  [R0603B]
R105  2k2  R0603  [R0603B]
R106  2k2  R0603  [R0603B]
R107  324R  R0603  [R0603B]
R108  10k  R0603  [R0603B]
RN9  2k2  R4_CAY16  [CAY16]
RN10  2k2  R4_CAY16  [CAY16]
RT38  10k  RT0603  [R0603Y]
RT39  10k  RT0603  [R0603Y]
RT40  10k  RT0603  [R0603Y]
RT41  10k  RT0603  [R0603Y]
RT42  10k  RT0603  [R0603Y]
RT45  10k  RT0603  [R0603Y]
RT46  10k  RT0603  [R0603Y]
RT47  10k  RT0603  [R0603Y]
RT48  10k  RT0603  [R0603Y]
RT49  10k  RT0603  [R0603Y]
S38  SPDTDB2CC1AA  [DB2CC1AA]
S39  SPDTDB2CC1AA  [DB2CC1AA]
S40  SPDTDB2CC1AA  [DB2CC1AA]
S41  SPDTDB2CC1AA  [DB2CC1AA]
S42  SPDTDB2CC1AA  [DB2CC1AA]
S45  SPDTDB2CC1AA  [DB2CC1AA]
S46  SPDTDB2CC1AA  [DB2CC1AA]
S47  SPDTDB2CC1AA  [DB2CC1AA]
S48  SPDTDB2CC1AA  [DB2CC1AA]
S49  SPDTDB2CC1AA  [DB2CC1AA]

### Nets
+3V3.C: C85.2 C86.2 C90.2 C92.2 FB5.2 IC23.5(OUT) IC25.1(S:VDD) IC25.24(S:VDD) IC25.48(S:VDD) J4.1(TVCC) R108.2 ; supply symbol labelled +3V3 ; also sheet 1
+5VB: C84.2 C87.2 C88.+ C89.+ C91.2 IC23.1(IN) IC23.3(EN) IC24.26(TEST) IC24.28(VCC) IC26.26(TEST) IC26.28(VCC) LED38.A1(ANODE_R) LED38.A2(ANODE_G) LED38.A3(ANODE_B) LED39.A1(ANODE_R) LED39.A2(ANODE_G) LED39.A3(ANODE_B) LED40.A1(ANODE_R) LED40.A2(ANODE_G) LED40.A3(ANODE_B) LED41.A1(ANODE_R) LED41.A2(ANODE_G) LED41.A3(ANODE_B) LED42.A1(ANODE_R) LED42.A2(ANODE_G) LED42.A3(ANODE_B) LED45.A1(ANODE_R) LED45.A2(ANODE_G) LED45.A3(ANODE_B) LED46.A1(ANODE_R) LED46.A2(ANODE_G) LED46.A3(ANODE_B) LED47.A1(ANODE_R) LED47.A2(ANODE_G) LED47.A3(ANODE_B) LED48.A1(ANODE_R) LED48.A2(ANODE_G) LED48.A3(ANODE_B) LED49.A1(ANODE_R) LED49.A2(ANODE_G) LED49.A3(ANODE_B) R95.2 R96.2 R97.2 R98.2 R100.2 R101.2 R102.2 R103.2 RT38.2 RT39.2 RT40.2 RT41.2 RT42.2 RT45.2 RT46.2 RT47.2 RT48.2 RT49.2 S38.4(NO) S39.4(NO) S40.4(NO) S41.4(NO) S42.4(NO) S45.4(NO) S46.4(NO) S47.4(NO) S48.4(NO) S49.4(NO) ; also sheet 1,2,5,8
BLANK2: IC24.2(BLANK) IC25.33(A:PA12) R100.1
BLANK2.1: IC25.6(S:PF1/OSC_OUT) IC26.2(BLANK) R98.1
CHAIN4: IC25.31(A:PA10) ; also sheet 5
GND: C83.1 C84.1 C85.1 C86.1 C87.1 C88.- C89.- C90.1 C91.1 C92.1 C93.1 C94.1 IC23.2(GND) IC24.1(GND) IC24.PAD(GND) IC25.8(S:VSSA) IC25.23(S:VSS) IC25.47(S:VSS) IC26.1(GND) IC26.PAD(GND) J4.5(GND) R99.1 R104.2 R105.2 R106.2 R107.1 RN9.A2 RN9.B2 RN9.C2 RN9.D2 RN10.A2 RN10.B2 RN10.C2 RN10.D2 S38.2(NC) S39.2(NC) S40.2(NC) S41.2(NC) S42.2(NC) S45.2(NC) S46.2(NC) S47.2(NC) S48.2(NC) S49.2(NC) ; also sheet 1,2,3,4,5,7,8,9
GSCLK2: IC24.25(GSCLK) IC25.32(A:PA11) IC26.25(GSCLK) R101.1
MISO2: IC25.27(B:PB14) IC26.24(SOUT)
MODE2: IC24.6(MODE) IC25.25(B:PB12) IC26.6(MODE) R102.1
MOSI2: IC24.5(SIN) IC25.28(B:PB15) R95.1
N$73: IC25.44(S:BOOT0) R104.1
N$74: C93.2 C94.2 FB5.1 IC25.9(S:VDDA)
N$75: C83.2 IC23.4(BYPASS)
N$76: IC24.24(SOUT) IC26.5(SIN)
N$77: IC26.27(IREF) R99.2
N$78: IC24.27(IREF) R107.2
N$79: IC24.7(OUT1) LED40.C3(CATHODE_B)
N$80: IC24.8(OUT2) LED40.C2(CATHODE_G)
N$81: IC24.9(OUT3) LED40.C1(CATHODE_R)
N$82: IC24.10(OUT4) LED39.C3(CATHODE_B)
N$83: IC24.11(OUT5) LED39.C2(CATHODE_G)
N$84: IC24.12(OUT6) LED39.C1(CATHODE_R)
N$85: IC24.13(OUT7) LED38.C3(CATHODE_B)
N$86: IC24.14(OUT8) LED38.C2(CATHODE_G)
N$87: IC24.15(OUT9) LED38.C1(CATHODE_R)
N$88: IC24.16(OUT10) LED45.C3(CATHODE_B)
N$89: IC24.17(OUT11) LED45.C2(CATHODE_G)
N$90: IC24.18(OUT12) LED45.C1(CATHODE_R)
N$91: IC24.19(OUT13) LED46.C3(CATHODE_B)
N$92: IC24.20(OUT14) LED46.C2(CATHODE_G)
N$93: IC24.21(OUT15) LED46.C1(CATHODE_R)
N$94: IC26.7(OUT1) LED47.C3(CATHODE_B)
N$95: IC26.8(OUT2) LED47.C2(CATHODE_G)
N$96: IC26.9(OUT3) LED47.C1(CATHODE_R)
N$97: IC26.10(OUT4) LED48.C3(CATHODE_B)
N$98: IC26.11(OUT5) LED48.C2(CATHODE_G)
N$99: IC26.12(OUT6) LED48.C1(CATHODE_R)
N$100: IC26.13(OUT7) LED49.C3(CATHODE_B)
N$101: IC26.14(OUT8) LED49.C2(CATHODE_G)
N$102: IC26.15(OUT9) LED49.C1(CATHODE_R)
N$103: IC26.16(OUT10) LED42.C3(CATHODE_B)
N$104: IC26.17(OUT11) LED42.C2(CATHODE_G)
N$105: IC26.18(OUT12) LED42.C1(CATHODE_R)
N$106: IC26.19(OUT13) LED41.C3(CATHODE_B)
N$107: IC26.20(OUT14) LED41.C2(CATHODE_G)
N$108: IC26.21(OUT15) LED41.C1(CATHODE_R)
N$192: IC25.30(A:PA9) R89.1
RST2: IC25.7(S:NRST) J4.3(RESET) R108.1
S1.11: IC25.39(B:PB3) S40.1(COM)
S1.12: IC25.36(S:PF7) S39.1(COM)
S1.13: IC25.41(B:PB5) S38.1(COM)
S1.14: IC25.21(B:PB10) S42.1(COM)
S1.15: IC25.22(B:PB11) S41.1(COM)
S2.11: IC25.20(B:PB2) S49.1(COM)
S2.12: IC25.42(B:PB6) S45.1(COM)
S2.13: IC25.43(B:PB7) S46.1(COM)
S2.14: IC25.5(S:PF0/OSC_IN) S47.1(COM)
S2.15: IC25.46(B:PB9) S48.1(COM)
SCK2: IC24.4(SCLK) IC25.26(B:PB13) IC26.4(SCLK) R97.1
SWCLK2: IC25.37(A:PA14) J4.4(SWCLK)
SWDIO2: IC25.34(A:PA13) J4.2(SWDIO)
SYNC: IC25.4(S:PC15/OSC32_OUT) ; also sheet 2,3,4,5
T21: IC25.14(A:PA4) RN9.D1 RT49.1
T22: IC25.15(A:PA5) RN9.C1 RT41.1
T23: IC25.16(A:PA6) RN9.B1 RT42.1
T24: IC25.17(A:PA7) RN9.A1 RT40.1
T25: IC25.18(B:PB0) R106.1 RT39.1
T26: IC25.19(B:PB1) R105.1 RT38.1
T27: IC25.13(A:PA3) RN10.A1 RT48.1
T28: IC25.12(A:PA2) RN10.B1 RT47.1
T29: IC25.11(A:PA1) RN10.C1 RT46.1
T30: IC25.10(A:PA0) RN10.D1 RT45.1
TIM3.3: IC25.40(B:PB4)
TIM16.3: IC25.45(B:PB8)
TX_OUT: R89.2 ; also sheet 1
XLAT2: IC24.3(XLAT) IC25.29(A:PA8) R96.1
XLAT2.1: IC25.35(S:PF6) IC26.3(XLAT) R103.1
Unconnected: IC24.22(OUT16) IC24.23(XERR) IC25.2(S:PC13/TAMPER/RTC) IC25.3(S:PC14/OSC32_IN) IC25.38(A:PA15) IC26.22(OUT16) IC26.23(XERR) J4.6(TRACESWO)

### Notes on the sheet
- 7x7 LED board
- LEDs controlled: 10
  Bus Address: 4
- T2.1
- T2.2
- T2.3
- T2.4
- T2.5
- T1.4
- T1.5
- T1.3
- XLAT
- TX
- RX
- GSCLK
- BLANK
- SWDIO
- SWCLK/BTX
- BRX
- buttons
- T1.2
- T1.1
- s2.5
- S1.2
- S1.3
- TIM3.1
- test for floating
  using pullup/down
- S1.1
- S2.1
- S2.2
- S2.3
- TIM16.1
- S2.4
- S1.5
- S1.4
- MODE
- SCK
- MISO
- MOSI

## Sheet 7 of 9
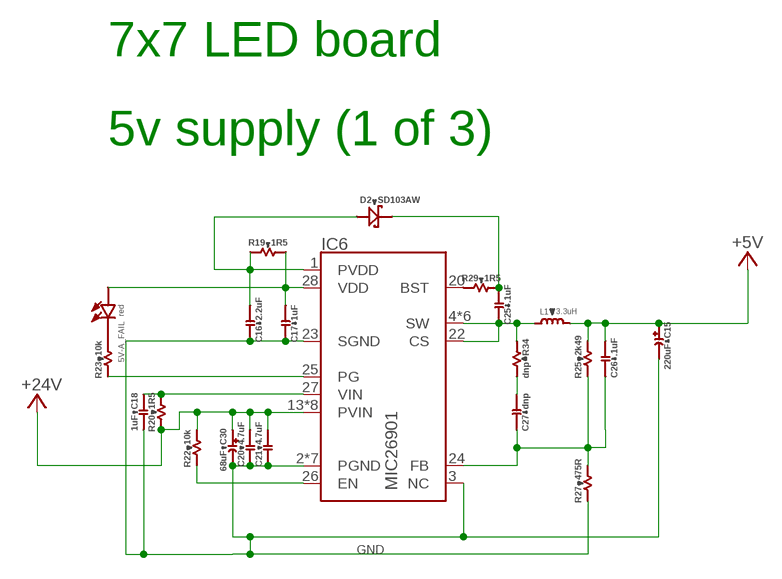
[diagram p6: schematic, sheet 7]

### Parts
5V-A_FAIL  red  LED0603  [CHIPLED_0603]
C15  220uF  CPOL-TH-3.5-8  [E3,5-8]
C16  2.2uF  C0603  [C0603B]
C17  1uF  C0603  [C0603B]
C18  1uF  C0603  [C0603B]
C20  4.7uF  C1206NT  [C1206NT]
C21  4.7uF  C1206NT  [C1206NT]
C25  .1uF  C0603  [C0603B]
C26  .1uF  C0603  [C0603B]
C27  dnp  C0603  [C0603B]
C30  68uF  CPOL-TH-5-10.5  [E5-10,5]
D2  SD103AW  SCHOTTKY323  [SOD-323]
IC6  MIC26901  [MLF28_5X6]
L1  3.3uH  L-SRP1265A  [SRP1265A]
R19  1R5  R0603  [R0603B]
R20  1R5  R0603  [R0603B]
R22  10k  R0603  [R0603B]
R23  10k  R0603  [R0603B]
R25  2k49  R0603  [R0603B]
R27  475R  R0603  [R0603B]
R29  1R5  R0603  [R0603B]
R34  dnp  R0603  [R0603B]

### Nets
+5V: C15.+ C26.2 L1.2 R25.2 ; also sheet 1,4,5
+24V: C20.2 C21.2 C30.+ IC6.13(PVIN) IC6.14(PVIN) IC6.15(PVIN) IC6.16(PVIN) IC6.17(PVIN) IC6.18(PVIN) IC6.19(PVIN) IC6.PVIN R20.1 R22.2 ; also sheet 1,4,8,9
GND: C15.- C16.1 C17.1 C18.2 C20.1 C21.1 C30.- IC6.2(PGND) IC6.3(NC) IC6.5(PGND) IC6.6(PGND) IC6.7(PGND) IC6.8(PGND) IC6.21(PGND) IC6.23(SGND) IC6.PGND R27.1 ; also sheet 1,2,3,4,5,6,8,9
N$189: C25.2 D2.C(K) R29.2
N$202: IC6.25(PG) R23.1
N$203: 5V-A_FAIL.C(CATHODE) R23.2
N$204: C16.2 D2.A IC6.1(PVDD) R19.1
N$205: 5V-A_FAIL.A(ANODE) C17.2 IC6.28(VDD) R19.2
N$206: C18.1 IC6.27(VIN) R20.2
N$207: IC6.26(EN) R22.1
N$208: C27.2 R34.2
N$209: C26.1 C27.1 IC6.24(FB) R25.1 R27.2
N$210: IC6.20(BST) R29.1
SW: C25.1 IC6.4(SW) IC6.9(SW) IC6.10(SW) IC6.11(SW) IC6.12(SW) IC6.22(CS) IC6.SW L1.1 R34.1

### Notes on the sheet
- 7x7 LED board
- 5v supply (1 of 3)

## Sheet 8 of 9
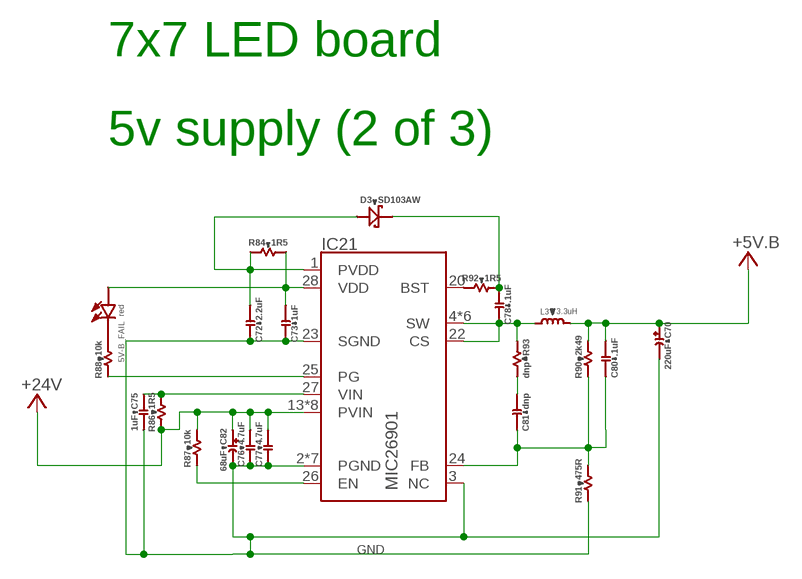
[diagram p7: schematic, sheet 8]

### Parts
5V-B_FAIL  red  LED0603  [CHIPLED_0603]
C70  220uF  CPOL-TH-3.5-8  [E3,5-8]
C72  2.2uF  C0603  [C0603B]
C73  1uF  C0603  [C0603B]
C75  1uF  C0603  [C0603B]
C76  4.7uF  C1206NT  [C1206NT]
C77  4.7uF  C1206NT  [C1206NT]
C78  .1uF  C0603  [C0603B]
C80  .1uF  C0603  [C0603B]
C81  dnp  C0603  [C0603B]
C82  68uF  CPOL-TH-5-10.5  [E5-10,5]
D3  SD103AW  SCHOTTKY323  [SOD-323]
IC21  MIC26901  [MLF28_5X6]
L3  3.3uH  L-SRP1265A  [SRP1265A]
R84  1R5  R0603  [R0603B]
R86  1R5  R0603  [R0603B]
R87  10k  R0603  [R0603B]
R88  10k  R0603  [R0603B]
R90  2k49  R0603  [R0603B]
R91  475R  R0603  [R0603B]
R92  1R5  R0603  [R0603B]
R93  dnp  R0603  [R0603B]

### Nets
+5VB: C70.+ C80.2 L3.2 R90.2 ; supply symbol labelled +5V.B ; also sheet 1,2,5,6
+24V: C76.2 C77.2 C82.+ IC21.13(PVIN) IC21.14(PVIN) IC21.15(PVIN) IC21.16(PVIN) IC21.17(PVIN) IC21.18(PVIN) IC21.19(PVIN) IC21.PVIN R86.1 R87.2 ; also sheet 1,4,7,9
GND: C70.- C72.1 C73.1 C75.2 C76.1 C77.1 C82.- IC21.2(PGND) IC21.3(NC) IC21.5(PGND) IC21.6(PGND) IC21.7(PGND) IC21.8(PGND) IC21.21(PGND) IC21.23(SGND) IC21.PGND R91.1 ; also sheet 1,2,3,4,5,6,7,9
N$211: C78.2 D3.C(K) R92.2
N$212: IC21.25(PG) R88.1
N$213: 5V-B_FAIL.C(CATHODE) R88.2
N$214: C72.2 D3.A IC21.1(PVDD) R84.1
N$215: 5V-B_FAIL.A(ANODE) C73.2 IC21.28(VDD) R84.2
N$216: C75.1 IC21.27(VIN) R86.2
N$217: IC21.26(EN) R87.1
N$218: C81.2 R93.2
N$219: C80.1 C81.1 IC21.24(FB) R90.1 R91.2
N$220: IC21.20(BST) R92.1
SW1: C78.1 IC21.4(SW) IC21.9(SW) IC21.10(SW) IC21.11(SW) IC21.12(SW) IC21.22(CS) IC21.SW L3.1 R93.1

### Notes on the sheet
- 7x7 LED board
- 5v supply (2 of 3)

## Sheet 9 of 9
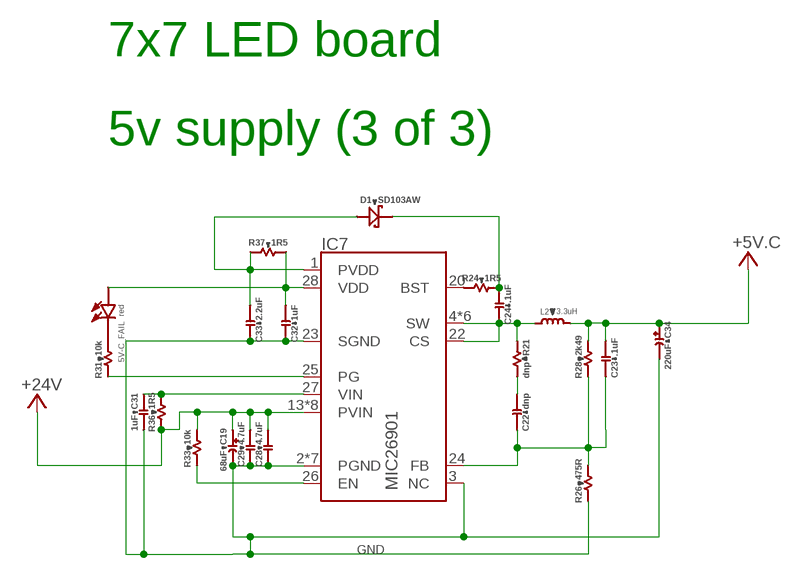
[diagram p8: schematic, sheet 9]

### Parts
5V-C_FAIL  red  LED0603  [CHIPLED_0603]
C19  68uF  CPOL-TH-5-10.5  [E5-10,5]
C22  dnp  C0603  [C0603B]
C23  .1uF  C0603  [C0603B]
C24  .1uF  C0603  [C0603B]
C28  4.7uF  C1206NT  [C1206NT]
C29  4.7uF  C1206NT  [C1206NT]
C31  1uF  C0603  [C0603B]
C32  1uF  C0603  [C0603B]
C33  2.2uF  C0603  [C0603B]
C34  220uF  CPOL-TH-3.5-8  [E3,5-8]
D1  SD103AW  SCHOTTKY323  [SOD-323]
IC7  MIC26901  [MLF28_5X6]
L2  3.3uH  L-SRP1265A  [SRP1265A]
R21  dnp  R0603  [R0603B]
R24  1R5  R0603  [R0603B]
R26  475R  R0603  [R0603B]
R28  2k49  R0603  [R0603B]
R31  10k  R0603  [R0603B]
R33  10k  R0603  [R0603B]
R36  1R5  R0603  [R0603B]
R37  1R5  R0603  [R0603B]

### Nets
+5VC: C23.2 C34.+ L2.2 R28.2 ; supply symbol labelled +5V.C ; also sheet 1,2,3
+24V: C19.+ C28.2 C29.2 IC7.13(PVIN) IC7.14(PVIN) IC7.15(PVIN) IC7.16(PVIN) IC7.17(PVIN) IC7.18(PVIN) IC7.19(PVIN) IC7.PVIN R33.2 R36.1 ; also sheet 1,4,7,8
GND: C19.- C28.1 C29.1 C31.2 C32.1 C33.1 C34.- IC7.2(PGND) IC7.3(NC) IC7.5(PGND) IC7.6(PGND) IC7.7(PGND) IC7.8(PGND) IC7.21(PGND) IC7.23(SGND) IC7.PGND R26.1 ; also sheet 1,2,3,4,5,6,7,8
N$221: C24.2 D1.C(K) R24.2
N$222: IC7.25(PG) R31.1
N$223: 5V-C_FAIL.C(CATHODE) R31.2
N$224: C33.2 D1.A IC7.1(PVDD) R37.1
N$225: 5V-C_FAIL.A(ANODE) C32.2 IC7.28(VDD) R37.2
N$226: C31.1 IC7.27(VIN) R36.2
N$227: IC7.26(EN) R33.1
N$228: C22.2 R21.2
N$229: C22.1 C23.1 IC7.24(FB) R26.2 R28.1
N$230: IC7.20(BST) R24.1
SW2: C24.1 IC7.4(SW) IC7.9(SW) IC7.10(SW) IC7.11(SW) IC7.12(SW) IC7.22(CS) IC7.SW L2.1 R21.1

### Notes on the sheet
- 7x7 LED board
- 5v supply (3 of 3)

## Library data of the parts
5V-A_FAIL 5V-B_FAIL 5V-C_FAIL = buttonwall:LED: Basic LED; PARTNO: LTST-C190KRKT
C1 C2 C4 C8-C11 C14 C24 C25 C36 C38 C40 C42-C45 C47 C50-C53 C55 C59 C60 C62 C66-C69 C71 C78 C79 C83 C84 C86 C90-C93 = buttonwall:C: Basic non-polarized capacitor; PARTNO: CGA3E2X7R1H104K080AA
C3 C5 C35 C37 C46 C48 C61 C63 C85 C87 = buttonwall:C: Basic non-polarized capacitor; PARTNO: C1608X6S1A106M080AC
C6 C7 C13 C39 C49 C56 C64 C65 C88 C89 = buttonwall:CPOL: Polarized capacitors; PARTNO: EKZN160ELL102MJ16S
C12 C17 C18 C31 C32 C41 C54 C73-C75 C94 = buttonwall:C: Basic non-polarized capacitor; PARTNO: CGA3E3X5R1H105K080AB
C15 C34 C70 = buttonwall:CPOL: Polarized capacitors; PARTNO: 16SEPC220MD
C16 C33 C72 = buttonwall:C: Basic non-polarized capacitor; PARTNO: C1608X5R1V225K080AC
C19 C30 C82 = buttonwall:CPOL: Polarized capacitors; PARTNO: PLV1H680MDL1
C20 C21 C28 C29 C76 C77 = rcl-cust:C: SMT Capacitor; PARTNO: UMK316AB7475KL-T
C22 C23 C26 C27 C80 C81 = buttonwall:C: Basic non-polarized capacitor; PARTNO: *
C57 = buttonwall:C: Basic non-polarized capacitor; PARTNO: CGA4J1X5R1C106K125AC
C58 = buttonwall:C: Basic non-polarized capacitor; PARTNO: CL31A106KBHNNNE
D1-D3 = diode:SCHOTTKY; PARTNO: SD103AWS-7-F
FB1-FB5 = buttonwall:FB; PARTNO: MMZ1608R102A
FUSE1 = buttonwall:F: Fuse or Fuseholder; PARTNO: 64900001039
IC1 IC8 IC11 IC16 IC23 = buttonwall:TC2185: Fixed LDO 150mA regulator with 6v max input 0.4% typ. accuracy 140mV typ. dropout 50uA ground current ceramic capcitor stable; PARTNO: TC2185-3.3VCTTR
IC2 IC4 IC5 IC10 IC12 IC14 IC17 IC19 IC24 IC26 = buttonwall:TLC59401: 16-CHANNEL LED DRIVER WITH DOT CORRECTION AND GRAYSCALE PWM CONTROL http://www.ti.com/lit/ds/symlink/tlc59401.pdf; PARTNO: TLC59401PWPR
IC3 IC9 IC13 IC18 IC25 = buttonwall:STM32F030C*: Value-line ARM ® -based 32-bit MCU with up to 256-KB Flash, timers, ADC, communication interfaces, 2.4-3.6 V operation; FLASH: 64k; PARTNO: STM32F030C8T6; RAM: 8k
IC6 IC7 IC21 = power:MIC26901: Micrel 28V, 9A Hper Speed Control Synchronous DC/DC Buck Regulator http://www.micrel.com/_PDF/MIC26901.pdf; PARTNO: MIC26901YJL-TR
IC15 = buttonwall:P7805-Q24-S12-S: Non-isolated switching regulator with 15-32V input range and 12V output at 500mA. 95% efficiency; PARTNO: P7805-Q24-S12-S
IC20 = onewire:DS2411: Silicon Serial Number with Vcc Input; PARTNO: 11AA02E48T-I/TT
IC22 = buttonwall:LTC2863: ±60V Fault Protected 3V to 5.5V RS485/RS422 Transceivers; PARTNO: LTC2863IS8-1#PBF
J1 = buttonwall:1X2: single row 2 circuit header; PARTNO: 640445-2
J2 = buttonwall:RJ12-JACK: 6p6c modular jack; PARTNO: RJE0166001
J3-J7 = buttonwall:STM32-SW: Programming header for single wire programming interface of the STM32 family of processor by ST
J8 = buttonwall:COMP_FAN; PARTNO: 0470531000
L1-L3 = buttonwall:L; PARTNO: SRP1265A-3R3M
L4 = buttonwall:L; PARTNO: MMZ1608R102A
LED1-LED49 = buttonwall:LED_RGB: 6 terminal RGB LED; PARTNO: LRTBC9TP-CWD5-1+D5E7-25+A
LED50-LED55 = buttonwall:LED: Basic LED; PARTNO: LTW-006DCG-E2
NUT1-NUT8 = buttonwall:NUT
PWR1 = buttonwall:EHHD024A0A: 18-75Vdc input 5Vdc output 24A/120W isolated DC-DC power module
Q1 = buttonwall:NFET-*: Single N-channel MOSFET; IMAX: 360mA@10Vgs; PARTNO: 2N7002P,215; QGATE: 0.6nC@4.5Vgs; RDS: 1.3@5Vgs; VDS: 60
R1 = buttonwall:R: Basic resistor; PARTNO: CRCW0805274RFKEA
R2 R14 R15 R38 R39 R65 R66 R80 R81 R105 R106 = buttonwall:R: Basic resistor; PARTNO: CRCW06032K20FKEA
R3 R44 R48 R70 R89 = buttonwall:R: Basic resistor; PARTNO: CRCW060347R5FKEA
R4-R7 R9-R13 R17 R22 R23 R30-R33 R40 R42 R43 R45-R47 R49 R50 R55-R62 R64 R68 R71-R74 R76-R79 R82 R85 R87 R88 R95-R98 R100-R104 R108 = buttonwall:R: Basic resistor; PARTNO: CRCW060310K0FKEA
R8 R16 R18 R41 R67 R69 R75 R83 R99 R107 = buttonwall:R: Basic resistor; PARTNO: CRCW0603324RFKEA
R19 R20 R24 R29 R36 R37 R84 R86 R92 = buttonwall:R: Basic resistor; PARTNO: CRCW06031R50FKEA
R21 R34 R53 R93 = buttonwall:R: Basic resistor; PARTNO: *
R25 R28 R90 = buttonwall:R: Basic resistor; PARTNO: CRCW06032K49FKEA
R26 R27 R91 = buttonwall:R: Basic resistor; PARTNO: CRCW0603475RFKEA
R35 R63 = buttonwall:R: Basic resistor
R51 R52 R54 = buttonwall:R: Basic resistor; PARTNO: CRCW06034K75FKEA
R94 = buttonwall:R: Basic resistor; PARTNO: CRCW1206120RFKEA
RN1-RN10 = buttonwall:R4: Resistor array with 4 isolated resistors. CTS_741 rated at 63 mW per resistor; PARTNO: CAY16-2201F4LF
RT1-RT49 = buttonwall:RT: Thermistors; PARTNO: NCP18XH103F03RB
S1-S49 = buttonwall:SPDT; PARTNO: DB2CC1AA
SCREW1-SCREW8 = buttonwall:SCREW-
TP1-TP5 = buttonwall:TP: Test Points
TVS1 = buttonwall:TVS; PARTNO: 4.0SMDJ24A